# EAGLE design bbb-cc2520 (EAGLE 6.5.0)
AUTHOR: Neal Jackson; REV: D; TITLE: GAP

## Sheet 1 of 5
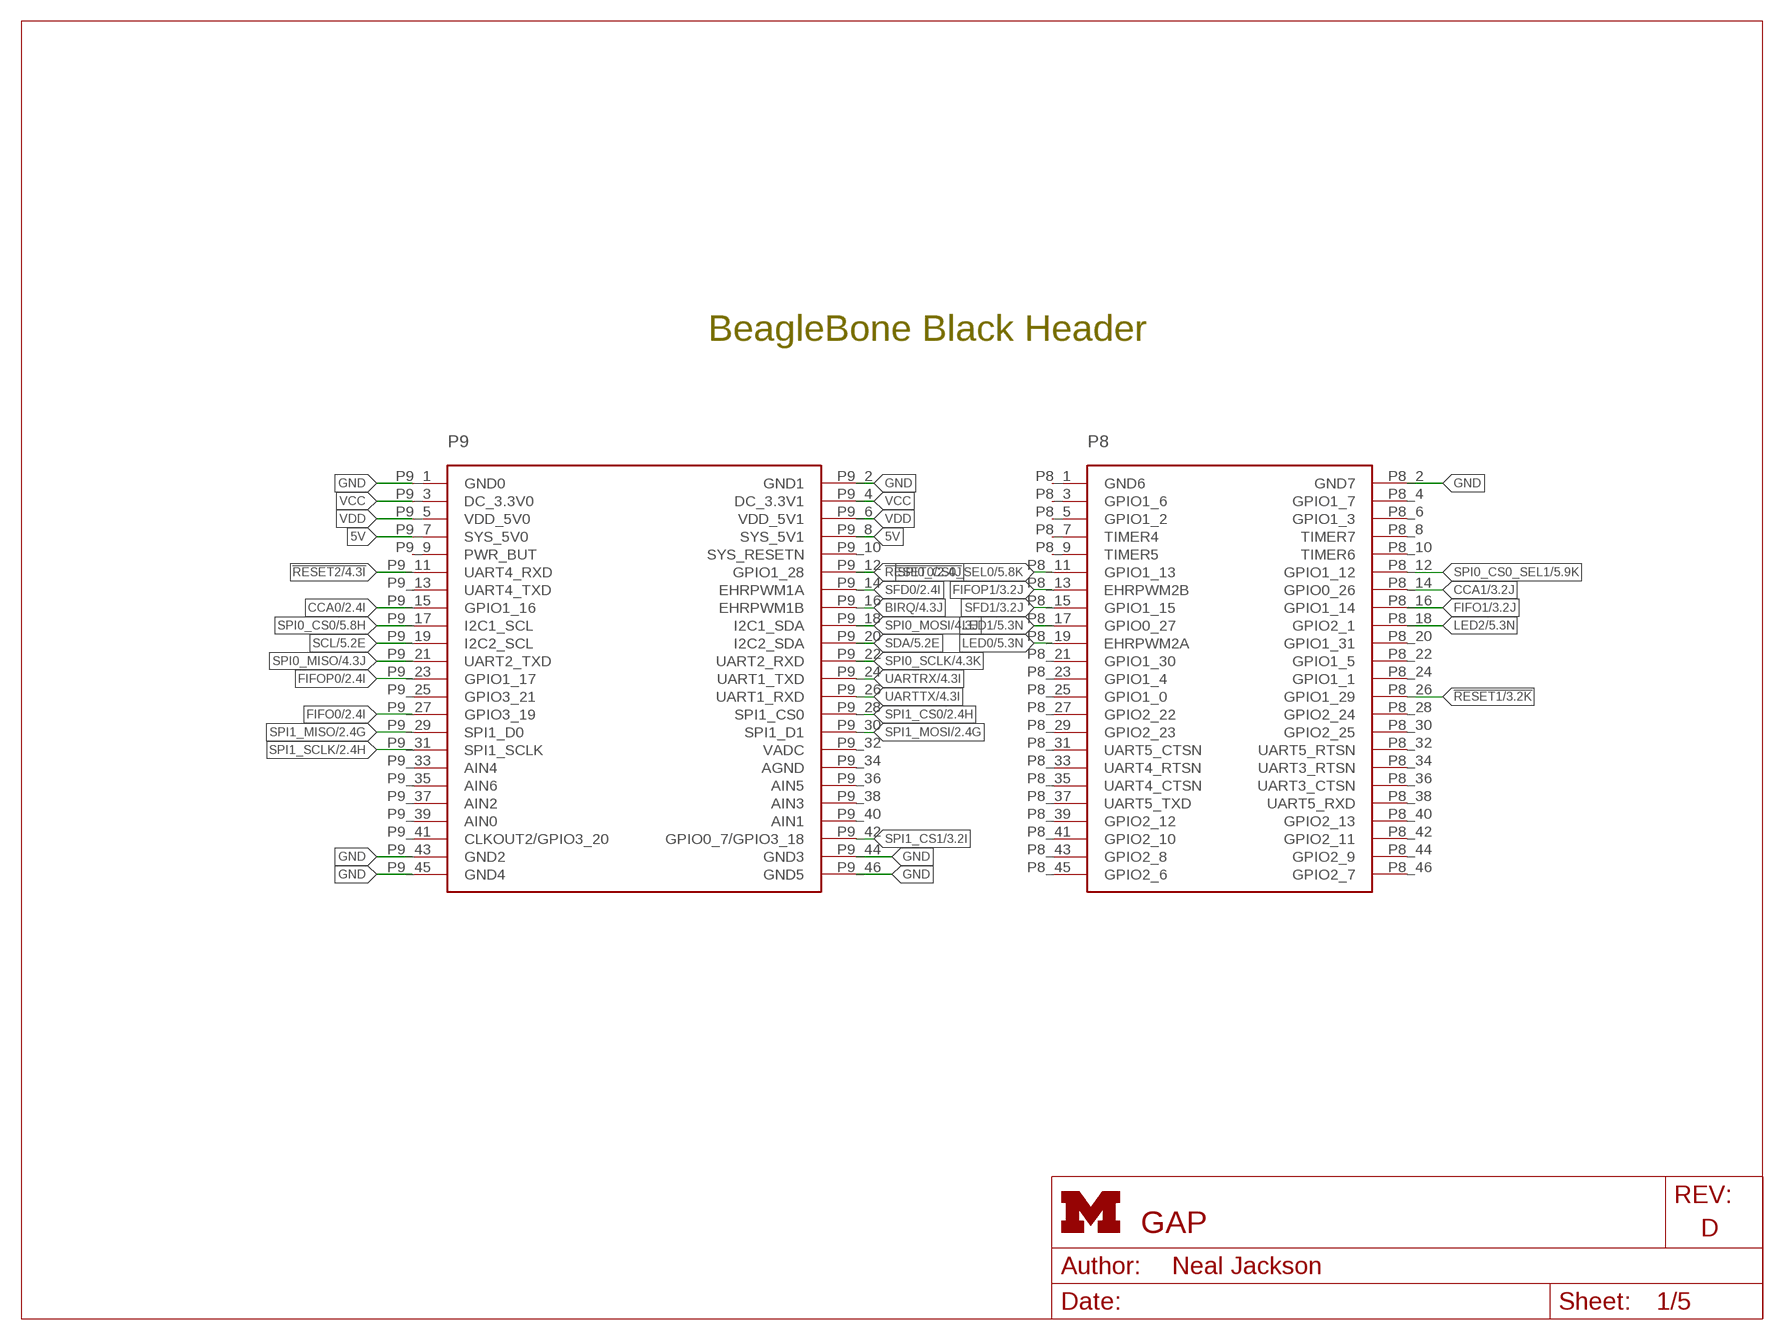
[diagram p0: schematic, sheet 1]
FRAME1 (LETTER_L): HEIGHT: 8.5in; WIDTH: 11in

### Parts
P9/P8  BBB_HEADERS  [BBB_HEADERS]

### Nets
5V: P9/P8.P9_7(SYS_5V0) P9/P8.P9_8(SYS_5V1)
!RESET0: P9/P8.P9_12(GPIO1_28) ; also sheet 2
!RESET1: P9/P8.P8_26(GPIO1_29) ; also sheet 3
!RESET2: P9/P8.P9_11(UART4_RXD) ; also sheet 4
BIRQ: P9/P8.P9_16(EHRPWM1B) ; also sheet 4
CCA0: P9/P8.P9_15(GPIO1_16) ; also sheet 2
CCA1: P9/P8.P8_14(GPIO0_26) ; also sheet 3
FIFO0: P9/P8.P9_27(GPIO3_19) ; also sheet 2
FIFO1: P9/P8.P8_16(GPIO1_14) ; also sheet 3
FIFOP0: P9/P8.P9_23(GPIO1_17) ; also sheet 2
FIFOP1: P9/P8.P8_13(EHRPWM2B) ; also sheet 3
GND: P9/P8.P8_2(GND7) P9/P8.P9_1(GND0) P9/P8.P9_2(GND1) P9/P8.P9_43(GND2) P9/P8.P9_44(GND3) P9/P8.P9_45(GND4) P9/P8.P9_46(GND5) ; also sheet 2,3,4,5
LED0: P9/P8.P8_19(EHRPWM2A) ; also sheet 5
LED1: P9/P8.P8_17(GPIO0_27) ; also sheet 5
LED2: P9/P8.P8_18(GPIO2_1) ; also sheet 5
SCL: P9/P8.P9_19(I2C2_SCL) ; also sheet 5
SDA: P9/P8.P9_20(I2C2_SDA) ; also sheet 5
SFD0: P9/P8.P9_14(EHRPWM1A) ; also sheet 2
SFD1: P9/P8.P8_15(GPIO1_15) ; also sheet 3
SPI0_CS0: P9/P8.P9_17(I2C1_SCL) ; also sheet 5
SPI0_CS0_SEL0: P9/P8.P8_11(GPIO1_13) ; also sheet 5
SPI0_CS0_SEL1: P9/P8.P8_12(GPIO1_12) ; also sheet 5
SPI0_MISO: P9/P8.P9_21(UART2_TXD) ; also sheet 4
SPI0_MOSI: P9/P8.P9_18(I2C1_SDA) ; also sheet 4
SPI0_SCLK: P9/P8.P9_22(UART2_RXD) ; also sheet 4
SPI1_CS0: P9/P8.P9_28(SPI1_CS0) ; also sheet 2
SPI1_CS1: P9/P8.P9_42(GPIO0_7/GPIO3_18) ; also sheet 3
SPI1_MISO: P9/P8.P9_29(SPI1_D0) ; also sheet 2,3
SPI1_MOSI: P9/P8.P9_30(SPI1_D1) ; also sheet 2,3
SPI1_SCLK: P9/P8.P9_31(SPI1_SCLK) ; also sheet 2,3
UARTRX: P9/P8.P9_24(UART1_TXD) ; also sheet 4
UARTTX: P9/P8.P9_26(UART1_RXD) ; also sheet 4
VCC: P9/P8.P9_3(DC_3.3V0) P9/P8.P9_4(DC_3.3V1) ; also sheet 2,3,4,5
VDD: P9/P8.P9_5(VDD_5V0) P9/P8.P9_6(VDD_5V1)
Unconnected: P9/P8.P8_1(GND6) P9/P8.P8_3(GPIO1_6) P9/P8.P8_4(GPIO1_7) P9/P8.P8_5(GPIO1_2) P9/P8.P8_6(GPIO1_3) P9/P8.P8_7(TIMER4) P9/P8.P8_8(TIMER7) P9/P8.P8_9(TIMER5) P9/P8.P8_10(TIMER6) P9/P8.P8_20(GPIO1_31) P9/P8.P8_21(GPIO1_30) P9/P8.P8_22(GPIO1_5) P9/P8.P8_23(GPIO1_4) P9/P8.P8_24(GPIO1_1) P9/P8.P8_25(GPIO1_0) P9/P8.P8_27(GPIO2_22) P9/P8.P8_28(GPIO2_24) P9/P8.P8_29(GPIO2_23) P9/P8.P8_30(GPIO2_25) P9/P8.P8_31(UART5_CTSN) P9/P8.P8_32(UART5_RTSN) P9/P8.P8_33(UART4_RTSN) P9/P8.P8_34(UART3_RTSN) P9/P8.P8_35(UART4_CTSN) P9/P8.P8_36(UART3_CTSN) P9/P8.P8_37(UART5_TXD) P9/P8.P8_38(UART5_RXD) P9/P8.P8_39(GPIO2_12) P9/P8.P8_40(GPIO2_13) P9/P8.P8_41(GPIO2_10) P9/P8.P8_42(GPIO2_11) P9/P8.P8_43(GPIO2_8) P9/P8.P8_44(GPIO2_9) P9/P8.P8_45(GPIO2_6) P9/P8.P8_46(GPIO2_7) P9/P8.P9_9(PWR_BUT) P9/P8.P9_10(SYS_RESETN) P9/P8.P9_13(UART4_TXD) P9/P8.P9_25(GPIO3_21) P9/P8.P9_32(VADC) P9/P8.P9_33(AIN4) P9/P8.P9_34(AGND) P9/P8.P9_35(AIN6) P9/P8.P9_36(AIN5) P9/P8.P9_37(AIN2) P9/P8.P9_38(AIN3) P9/P8.P9_39(AIN0) P9/P8.P9_40(AIN1) P9/P8.P9_41(CLKOUT2/GPIO3_20)

### Notes on the sheet
- BeagleBone Black Header

## Sheet 2 of 5
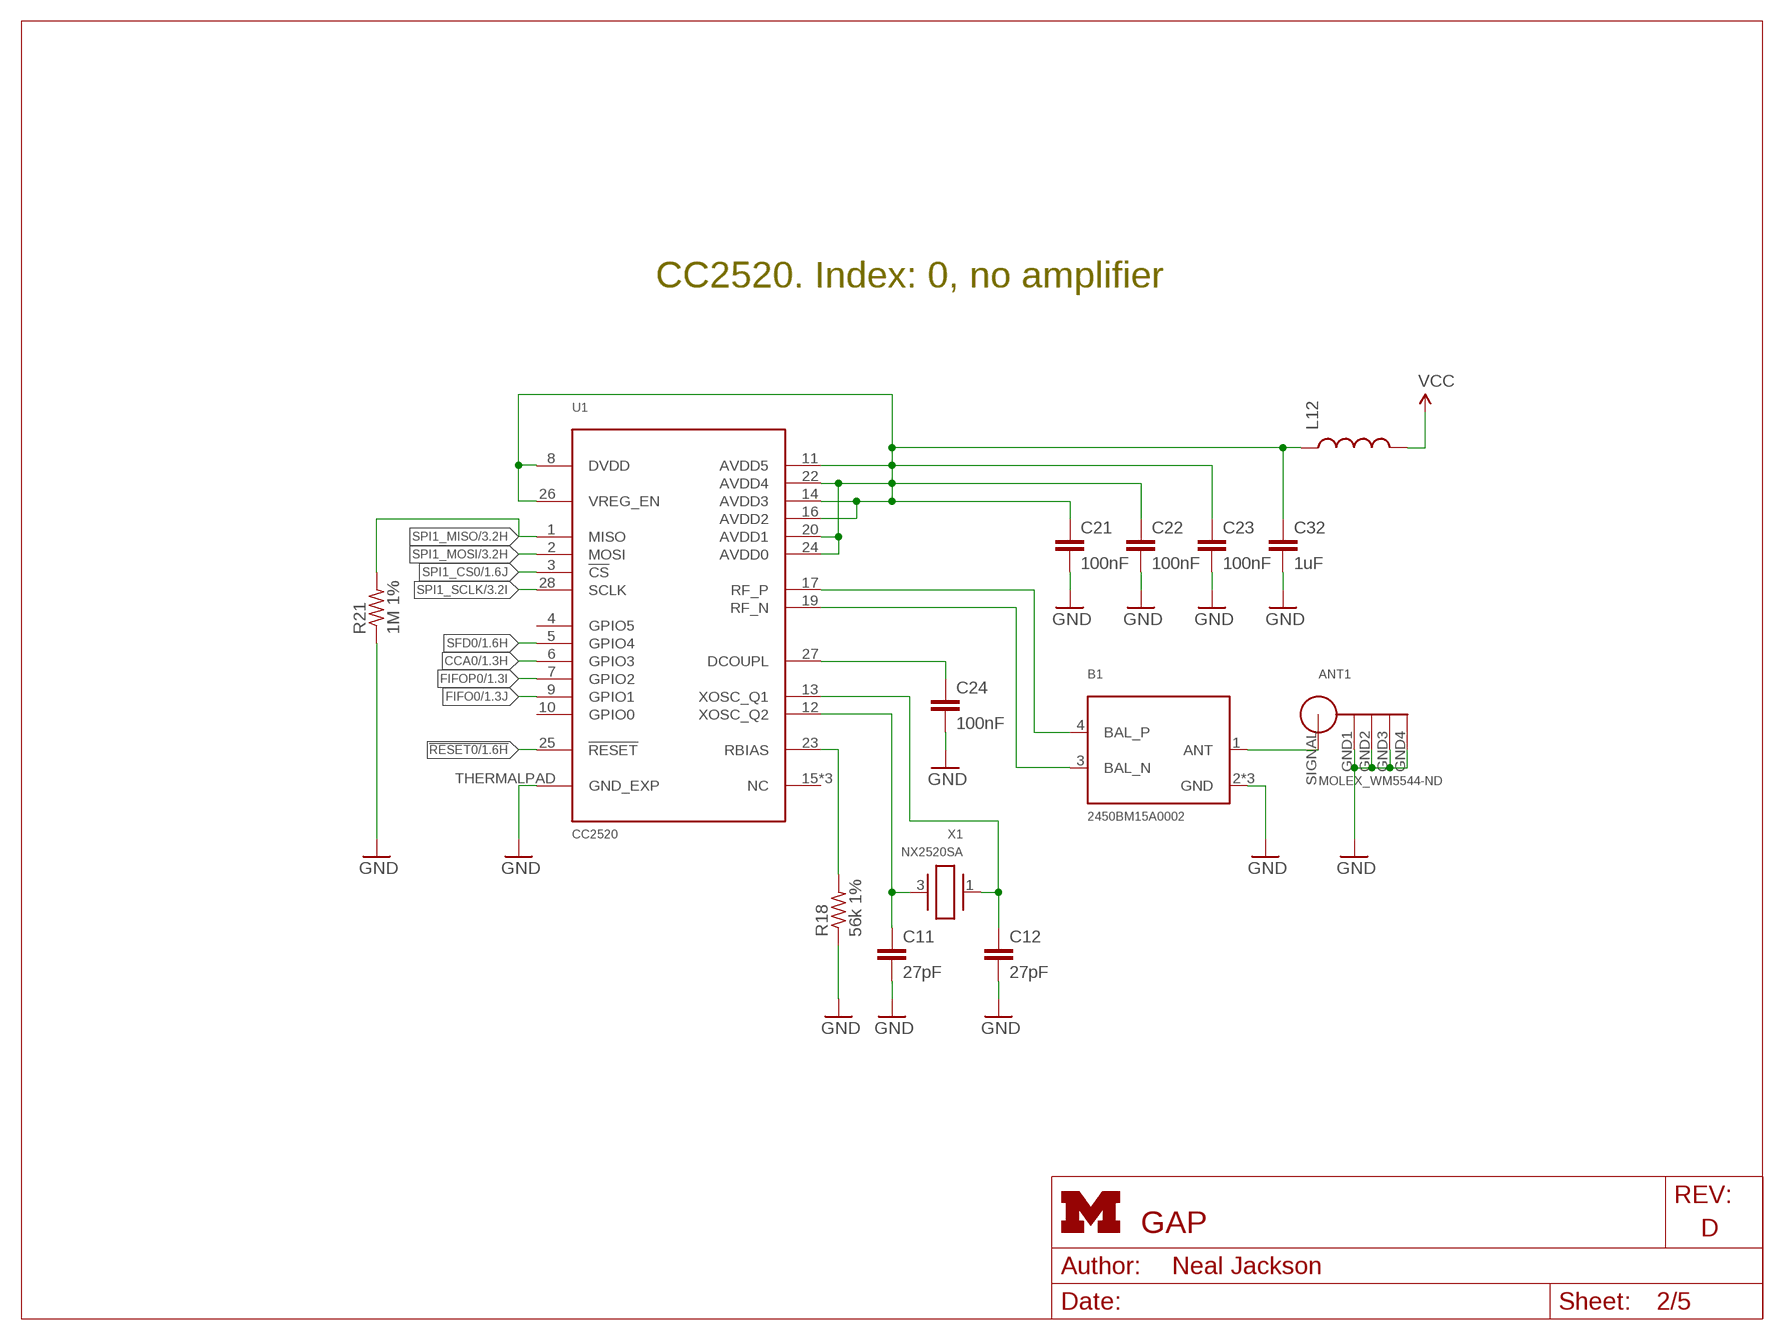
[diagram p1: schematic, sheet 2]
FRAME6 (LETTER_L): HEIGHT: 8.5in; WIDTH: 11in

### Parts
ANT1  MOLEX_WM5544-ND  [MOLEX_WM5544-ND]
B1  2450BM15A0002  [2450BM]
C11  27pF  C-EUC0402  [C0402]
C12  27pF  C-EUC0402  [C0402]
C21  100nF  C-EUC0402  [C0402]
C22  100nF  C-EUC0402  [C0402]
C23  100nF  C-EUC0402  [C0402]
C24  100nF  C-EUC0402  [C0402]
C32  1uF  C-EUC0603  [C0603]
L12  INDUCTOR0603  [0603]
R18  56k 1%  R-US_R0402  [R0402]
R21  1M 1%  R-US_R0402  [R0402]
U1  CC2520  [S-PVQFN-N28]
X1  NX2520SA  [NX2520SA]

### Nets
!RESET0: U1.25(!RESET) ; also sheet 1
CCA0: U1.6(GPIO3) ; also sheet 1
FIFO0: U1.9(GPIO1) ; also sheet 1
FIFOP0: U1.7(GPIO2) ; also sheet 1
GND: ANT1.GND1 ANT1.GND2 ANT1.GND3 ANT1.GND4 B1.2(GND) B1.5(GND) B1.6(GND) C11.2 C12.2 C21.2 C22.2 C23.2 C24.2 C32.2 R18.1 R21.1 U1.THERMALPAD(GND_EXP) ; also sheet 1,3,4,5
N$5: C21.1 C22.1 C23.1 C32.1 L12.1 U1.8(DVDD) U1.11(AVDD5) U1.14(AVDD3) U1.16(AVDD2) U1.20(AVDD1) U1.22(AVDD4) U1.24(AVDD0) U1.26(VREG_EN)
N$7: ANT1.SIGNAL B1.1(ANT)
N$11: C12.1 U1.13(XOSC_Q1) X1.1
N$12: C24.1 U1.27(DCOUPL)
N$13: C11.1 U1.12(XOSC_Q2) X1.3
N$14: R18.2 U1.23(RBIAS)
RF_N: B1.3(BAL_N) U1.19(RF_N)
RF_P: B1.4(BAL_P) U1.17(RF_P)
SFD0: U1.5(GPIO4) ; also sheet 1
SPI1_CS0: U1.3(!CS) ; also sheet 1
SPI1_MISO: R21.2 U1.1(MISO) ; also sheet 1,3
SPI1_MOSI: U1.2(MOSI) ; also sheet 1,3
SPI1_SCLK: U1.28(SCLK) ; also sheet 1,3
VCC: L12.2 ; also sheet 1,3,4,5
Unconnected: U1.4(GPIO5) U1.10(GPIO0) U1.15(NC) U1.18(NC) U1.21(NC)

### Notes on the sheet
- CC2520. Index: 0, no amplifier

## Sheet 3 of 5
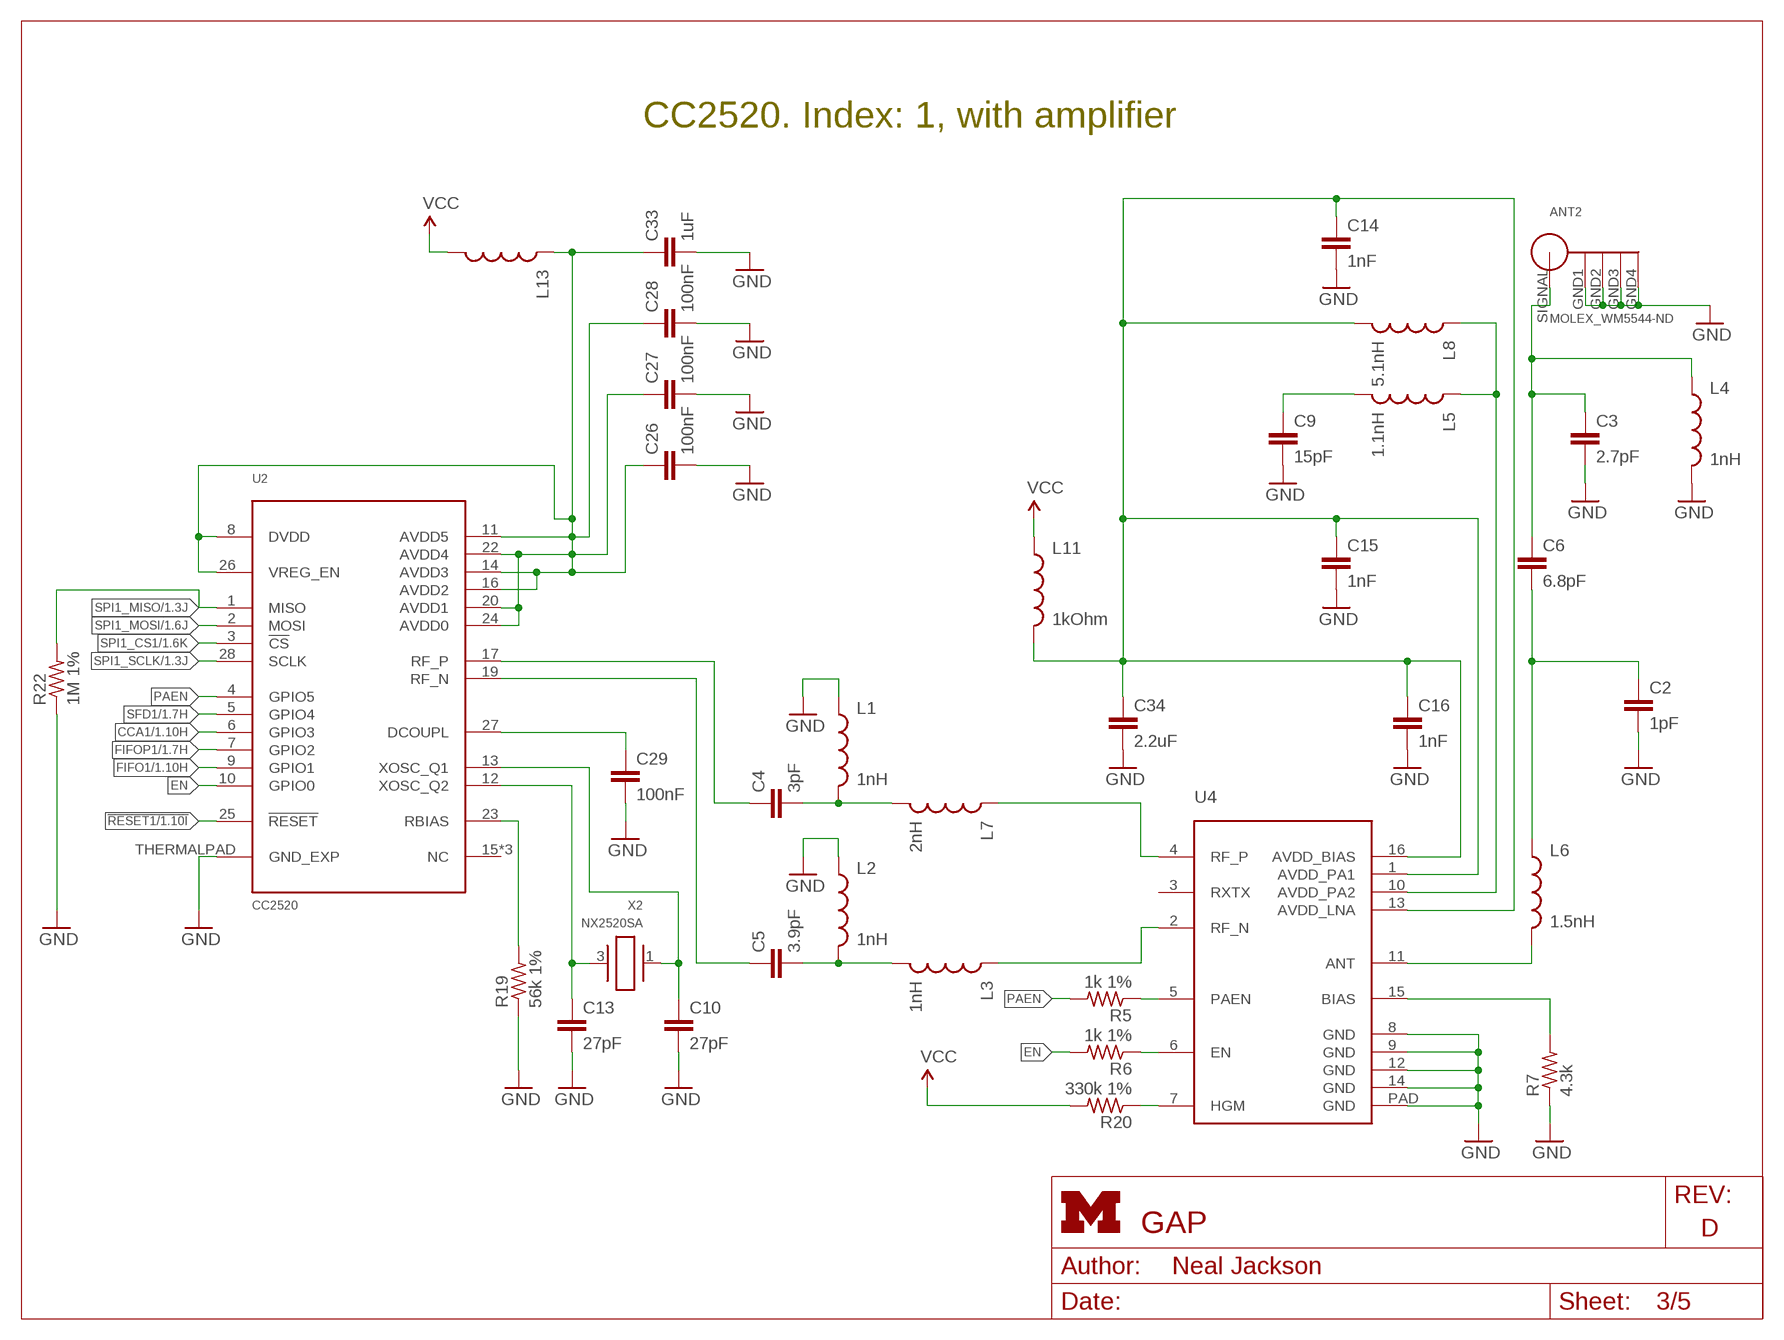
[diagram p2: schematic, sheet 3]
FRAME3 (LETTER_L): HEIGHT: 8.5in; WIDTH: 11in

### Parts
ANT2  MOLEX_WM5544-ND  [MOLEX_WM5544-ND]
C2  1pF  C-EUC0402  [C0402]
C3  2.7pF  C-EUC0402  [C0402]
C4  3pF  C-EUC0402  [C0402]
C5  3.9pF  C-EUC0402  [C0402]
C6  6.8pF  C-EUC0402  [C0402]
C9  15pF  C-EUC0402  [C0402]
C10  27pF  C-EUC0402  [C0402]
C13  27pF  C-EUC0402  [C0402]
C14  1nF  C-EUC0402  [C0402]
C15  1nF  C-EUC0402  [C0402]
C16  1nF  C-EUC0402  [C0402]
C26  100nF  C-EUC0402  [C0402]
C27  100nF  C-EUC0402  [C0402]
C28  100nF  C-EUC0402  [C0402]
C29  100nF  C-EUC0402  [C0402]
C33  1uF  C-EUC0603  [C0603]
C34  2.2uF  C-EUC0402  [C0402]
L1  1nH  INDUCTOR0402  [C0402]
L2  1nH  INDUCTOR0402  [C0402]
L3  1nH  INDUCTOR0402  [C0402]
L4  1nH  INDUCTOR0402  [C0402]
L5  1.1nH  INDUCTOR0402  [C0402]
L6  1.5nH  INDUCTOR0402  [C0402]
L7  2nH  INDUCTOR0402  [C0402]
L8  5.1nH  INDUCTOR0402  [C0402]
L11  1kOhm  INDUCTOR0402  [C0402]
L13  INDUCTOR0603  [0603]
R5  1k 1%  R-US_R0402  [R0402]
R6  1k 1%  R-US_R0402  [R0402]
R7  4.3k  R-US_R0402  [R0402]
R19  56k 1%  R-US_R0402  [R0402]
R20  330k 1%  R-US_R0402  [R0402]
R22  1M 1%  R-US_R0402  [R0402]
U2  CC2520  [S-PVQFN-N28]
U4  CC2591  [PVQFN-16]
X2  NX2520SA  [NX2520SA]

### Nets
!RESET1: U2.25(!RESET) ; also sheet 1
CCA1: U2.6(GPIO3) ; also sheet 1
EN: R6.2 U2.10(GPIO0)
FIFO1: U2.9(GPIO1) ; also sheet 1
FIFOP1: U2.7(GPIO2) ; also sheet 1
GND: ANT2.GND1 ANT2.GND2 ANT2.GND3 ANT2.GND4 C2.2 C3.2 C9.2 C10.2 C13.2 C14.2 C15.2 C16.2 C26.2 C27.2 C28.2 C29.2 C33.2 C34.2 L1.1 L2.1 L4.2 R7.1 R19.1 R22.1 U2.THERMALPAD(GND_EXP) U4.8(GND) U4.9(GND) U4.12(GND) U4.14(GND) U4.PAD(GND) ; also sheet 1,2,4,5
N$44: L7.1 U4.4(RF_P)
N$45: L3.1 U4.2(RF_N)
N$46: C5.2 L2.2 L3.2
N$47: C4.2 L1.2 L7.2
N$48: L5.1 L8.1 U4.10(AVDD_PA2)
N$49: C14.1 C15.1 C16.1 C34.1 L8.2 L11.2 U4.1(AVDD_PA1) U4.13(AVDD_LNA) U4.16(AVDD_BIAS)
N$50: C9.1 L5.2
N$51: L6.2 U4.11(ANT)
N$52: ANT2.SIGNAL C3.1 C6.1 L4.1
N$53: C2.1 C6.2 L6.1
N$54: R7.2 U4.15(BIAS)
N$55: R5.1 U4.5(PAEN)
N$56: R6.1 U4.6(EN)
N$57: C26.1 C27.1 C28.1 C33.1 L13.1 U2.8(DVDD) U2.11(AVDD5) U2.14(AVDD3) U2.16(AVDD2) U2.20(AVDD1) U2.22(AVDD4) U2.24(AVDD0) U2.26(VREG_EN)
N$58: C29.1 U2.27(DCOUPL)
N$59: C10.1 U2.13(XOSC_Q1) X2.1
N$60: C13.1 U2.12(XOSC_Q2) X2.3
N$61: R19.2 U2.23(RBIAS)
N$62: R20.1 U4.7(HGM)
PAEN: R5.2 U2.4(GPIO5)
RF_N2: C5.1 U2.19(RF_N)
RF_P2: C4.1 U2.17(RF_P)
SFD1: U2.5(GPIO4) ; also sheet 1
SPI1_CS1: U2.3(!CS) ; also sheet 1
SPI1_MISO: R22.2 U2.1(MISO) ; also sheet 1,2
SPI1_MOSI: U2.2(MOSI) ; also sheet 1,2
SPI1_SCLK: U2.28(SCLK) ; also sheet 1,2
VCC: L11.1 L13.2 R20.2 ; also sheet 1,2,4,5
Unconnected: U2.15(NC) U2.18(NC) U2.21(NC) U4.3(RXTX)

### Notes on the sheet
- CC2520. Index: 1, with amplifier

## Sheet 4 of 5
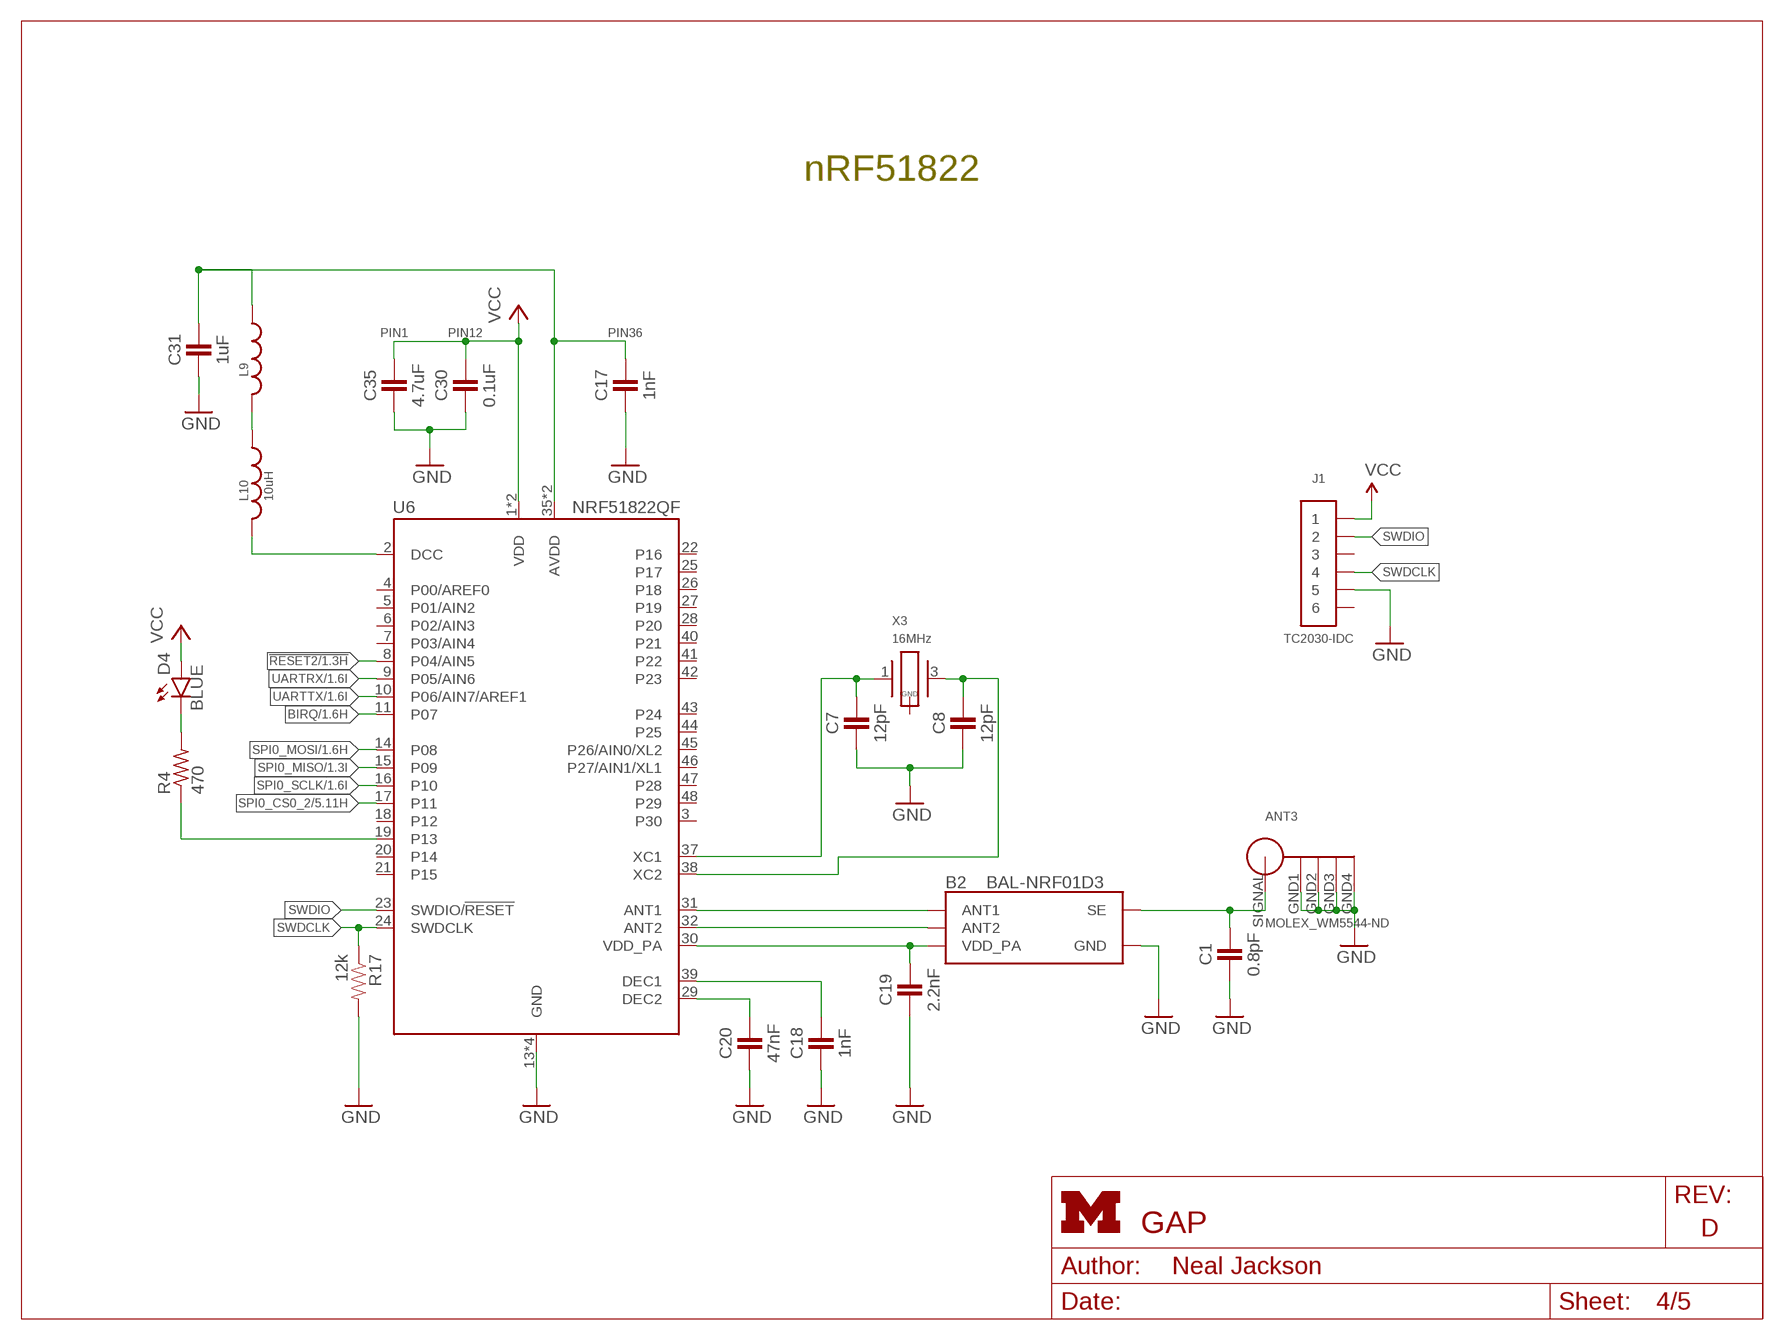
[diagram p3: schematic, sheet 4]
FRAME2 (LETTER_L): HEIGHT: 8.5in; WIDTH: 11in

### Parts
ANT3  MOLEX_WM5544-ND  [MOLEX_WM5544-ND]
B2  BAL-NRF01D3  [BAL-NRF01D3]
C1  0.8pF  CAPACITOR  [0402_CAP]
C7  12pF  CAPACITOR  [0402_CAP]
C8  12pF  CAPACITOR  [0402_CAP]
C17  1nF  CAPACITOR  [0402_CAP]
C18  1nF  CAPACITOR  [0402_CAP]
C19  2.2nF  CAPACITOR  [0402_CAP]
C20  47nF  CAPACITOR  [0402_CAP]
C30  0.1uF  CAPACITOR  [0402_CAP]
C31  1uF  CAPACITOR  [0402_CAP]
C35  4.7uF  CAPACITOR  [0402_CAP]
D4  BLUE  LED0603  [LED-0603]
J1  TC2030-IDC  [TC2030-IDC]
L9  INDUCTOR0402  [0402_CAP]
L10  10uH  INDUCTOR0603  [0603_CAP]
R4  470  R-US_R0402  [R0402]
R17  12k  RESISTOR  [0603-RES]
U6  NRF51822QF  [QFN-48-6MM]
X3  16MHz  TXC-8Y  [TXC-8Y]

### Nets
!RESET2: U6.8(P04/AIN5) ; also sheet 1
AVDD: C17.1 C31.1 L9.1 U6.35(AVDD) U6.36(AVDD)
BIRQ: U6.11(P07) ; also sheet 1
DCC: L10.2 U6.2(DCC)
GND: ANT3.GND1 ANT3.GND2 ANT3.GND3 ANT3.GND4 B2.GND C1.2 C7.2 C8.2 C17.2 C18.2 C19.2 C20.2 C30.2 C31.2 C35.2 J1.5 R17.2 U6.13(GND) U6.33(GND) U6.34(GND) U6.GND ; also sheet 1,2,3,5
N$36: B2.ANT1 U6.31(ANT1)
N$37: B2.ANT2 U6.32(ANT2)
N$38: ANT3.SIGNAL B2.SE C1.1
N$39: L9.2 L10.1
N$40: C7.1 U6.37(XC1) X3.1
N$41: C8.1 U6.38(XC2) X3.3
N$42: C18.1 U6.39(DEC1)
N$43: C20.1 U6.29(DEC2)
N$63: D4.C R4.2
N$64: R4.1 U6.19(P13)
SPI0_CS0_2: U6.17(P11) ; also sheet 5
SPI0_MISO: U6.15(P09) ; also sheet 1
SPI0_MOSI: U6.14(P08) ; also sheet 1
SPI0_SCLK: U6.16(P10) ; also sheet 1
SWDCLK: J1.4 R17.1 U6.24(SWDCLK)
SWDIO: J1.2 U6.23(SWDIO/!RESET)
UARTRX: U6.9(P05/AIN6) ; also sheet 1
UARTTX: U6.10(P06/AIN7/AREF1) ; also sheet 1
VCC: C30.1 C35.1 D4.A J1.1 U6.1(VDD) U6.12(VDD) ; also sheet 1,2,3,5
VDD_PA: B2.VCC(VDD_PA) C19.1 U6.30(VDD_PA)
Unconnected: J1.3 J1.6 U6.3(P30) U6.4(P00/AREF0) U6.5(P01/AIN2) U6.6(P02/AIN3) U6.7(P03/AIN4) U6.18(P12) U6.20(P14) U6.21(P15) U6.22(P16) U6.25(P17) U6.26(P18) U6.27(P19) U6.28(P20) U6.40(P21) U6.41(P22) U6.42(P23) U6.43(P24) U6.44(P25) U6.45(P26/AIN0/XL2) U6.46(P27/AIN1/XL1) U6.47(P28) U6.48(P29) X3.2(GND) X3.4(GND)

### Notes on the sheet
- nRF51822
- PIN1 | PIN12 | PIN36

## Sheet 5 of 5
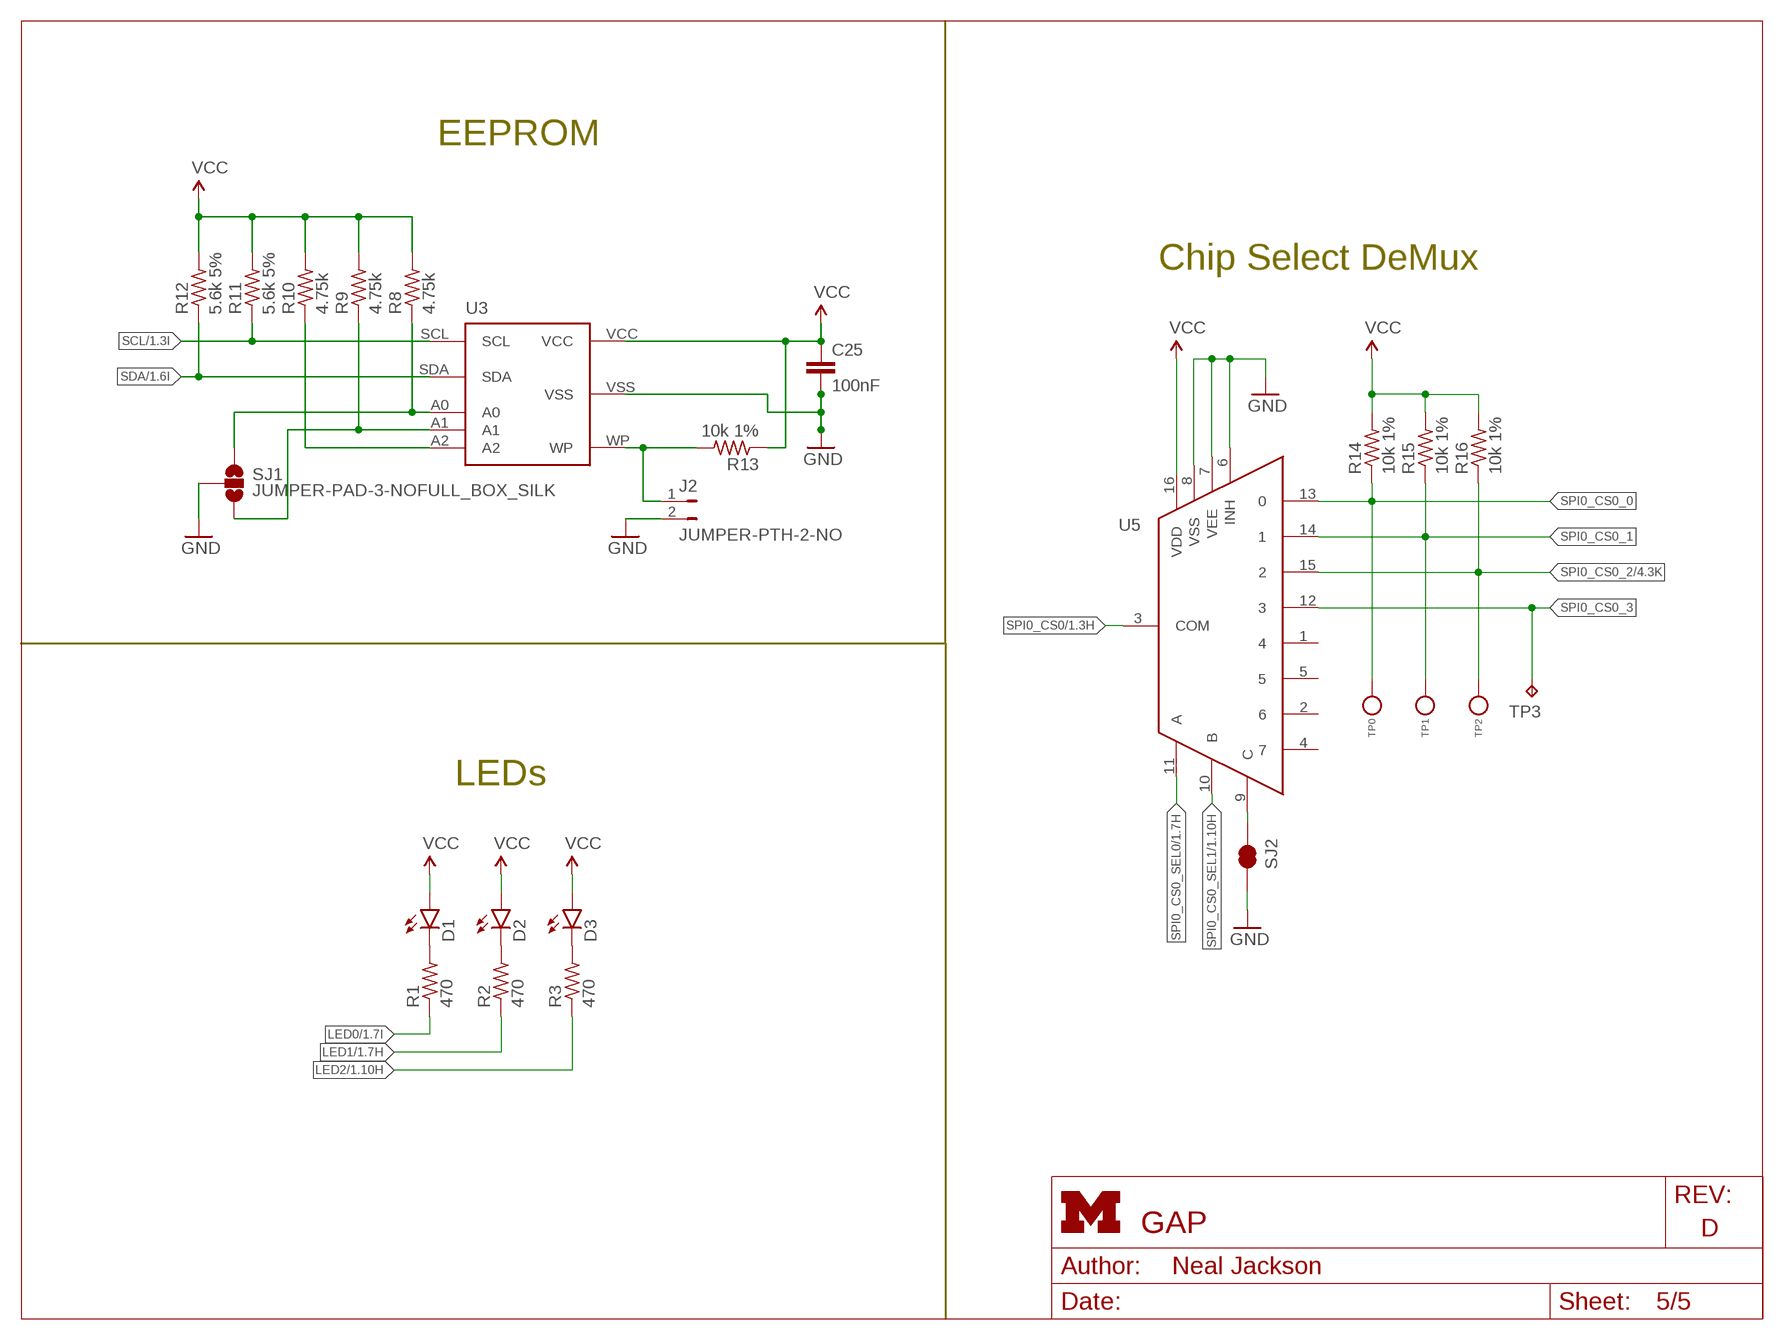
[diagram p4: schematic, sheet 5]
FRAME4 (LETTER_L): HEIGHT: 8.5in; WIDTH: 11in

### Parts
C25  100nF  C-EUC0402  [C0402]
D1  LED0603  [LED-0603]
D2  LED0603  [LED-0603]
D3  LED0603  [LED-0603]
J2  JUMPER-PTH-2-NO  [PTH-JUMPER-2-NO_NO_SILK]
R1  470  R-US_R0402  [R0402]
R2  470  R-US_R0402  [R0402]
R3  470  R-US_R0402  [R0402]
R8  4.75k  R-US_R0402  [R0402]
R9  4.75k  R-US_R0402  [R0402]
R10  4.75k  R-US_R0402  [R0402]
R11  5.6k 5%  R-US_R0402  [R0402]
R12  5.6k 5%  R-US_R0402  [R0402]
R13  10k 1%  R-US_R0402  [R0402]
R14  10k 1%  R-US_R0402  [R0402]
R15  10k 1%  R-US_R0402  [R0402]
R16  10k 1%  R-US_R0402  [R0402]
SJ1  JUMPER-PAD-3-NOFULL_BOX_SILK  [PAD-JUMPER-3-NO_YES_SILK_FULL_BOX]
SJ2  JUMPER-PAD-2-NC_BY_TRACE  [PAD-JUMPER-2-NC_BY_TRACE_YES_SILK]
TP0  TEST_POINT_0.040IN  [TESTPOINT_0.040IN]
TP1  TEST_POINT_0.040IN  [TESTPOINT_0.040IN]
TP2  TEST_POINT_0.040IN  [TESTPOINT_0.040IN]
TP3  TPTP14SQ  [TP14SQ]
U3  CAT24C256WI-GT3  [CAT24C256WI-GT3]
U5  CD4051B-53B  [TSSOP16]

### Nets
GND: C25.2 J2.2 SJ1.2 SJ2.2 U3.VSS U5.6(INH) U5.7(VEE) U5.8(VSS) ; also sheet 1,2,3,4
LED0: R1.1 ; also sheet 1
LED1: R2.1 ; also sheet 1
LED2: R3.1 ; also sheet 1
N$1: D1.C R1.2
N$2: D2.C R2.2
N$3: D3.C R3.2
N$29: R8.1 SJ1.1 U3.A0
N$30: R9.1 SJ1.3 U3.A1
N$31: J2.1 R13.2 U3.WP
N$32: R10.1 U3.A2
N$65: SJ2.1 U5.9(C)
SCL: R11.1 U3.SCL ; also sheet 1
SDA: R12.1 U3.SDA ; also sheet 1
SPI0_CS0: U5.3(COM) ; also sheet 1
SPI0_CS0_0: R14.1 TP0.TESTPOINT U5.13
SPI0_CS0_1: R15.1 TP1.TESTPOINT U5.14
SPI0_CS0_2: R16.1 TP2.TESTPOINT U5.15 ; also sheet 4
SPI0_CS0_3: TP3.TP U5.12
SPI0_CS0_SEL0: U5.11(A) ; also sheet 1
SPI0_CS0_SEL1: U5.10(B) ; also sheet 1
VCC: C25.1 D1.A D2.A D3.A R8.2 R9.2 R10.2 R11.2 R12.2 R13.1 R14.2 R15.2 R16.2 U3.VCC U5.16(VDD) ; also sheet 1,2,3,4
Unconnected: U5.1 U5.2 U5.4 U5.5

### Notes on the sheet
- EEPROM
- Chip Select DeMux
- LEDs

## Library data of the parts
ANT1-ANT3 = connector:MOLEX_WM5544-ND: Through-hole SMA Antenna; DIGIKEY: WM5544-ND
B1 = rpi-cc2520:2450BM15A0002: BALUN JTI MATCHED ZIGBEE; DIGIKEY: 712-1536-1-ND
B2 = chips:BAL-NRF01D3: 50 ohm nominal input / conjugate match balun to nRF51422-QFAA, nRF24LE1, nRF51822-QFAA/AB, with integrated harmonic filter; DIGIKEY: 497-13637-1-ND; MOUSER: 511-BAL-NRF01D3
C1 C19 = passives:CAPACITOR: 0402 Capacitor; DIGIKEY: 490-5419-1-ND
C2-C6 C9 C14-C16 C21-C29 C34 = rcl:C-EU: CAPACITOR, European symbol; DIGIKEY: 490-1318-1-ND
C7 C8 = passives:CAPACITOR: 0402 Capacitor; DIGIKEY: 490-6197-1-ND
C10-C13 = rcl:C-EU: CAPACITOR, European symbol; DIGIKEY: 490-5869-1-ND
C17 C18 = passives:CAPACITOR: 0402 Capacitor; DIGIKEY: 490-1303-1-ND
C20 = passives:CAPACITOR: 0402 Capacitor; DIGIKEY: 445-1264-1-ND
C30 = passives:CAPACITOR: 0402 Capacitor; DIGIKEY: 445-4952-1-ND
C31 = passives:CAPACITOR: 0402 Capacitor; DIGIKEY: 1276-1513-1-ND
C32 C33 = rcl:C-EU: CAPACITOR, European symbol; DIGIKEY: 490-1550-1-ND
C35 = passives:CAPACITOR: 0402 Capacitor; DIGIKEY: 445-5947-1-ND
D1 = SparkFun-LED:LED: LEDs Standard schematic elements and footprints for 5mm, 3mm, 1206, and 0603 sized LEDs. 5mm - Spark Fun Electronics SKU : COM-00529 (and others); DIGIKEY: 160-1834-1-ND
D2 = SparkFun-LED:LED: LEDs Standard schematic elements and footprints for 5mm, 3mm, 1206, and 0603 sized LEDs. 5mm - Spark Fun Electronics SKU : COM-00529 (and others); DIGIKEY: 160-1835-1-ND
D3 = SparkFun-LED:LED: LEDs Standard schematic elements and footprints for 5mm, 3mm, 1206, and 0603 sized LEDs. 5mm - Spark Fun Electronics SKU : COM-00529 (and others); DIGIKEY: 160-1837-1-ND
D4 = SparkFun-LED:LED: LEDs Standard schematic elements and footprints for 5mm, 3mm, 1206, and 0603 sized LEDs. 5mm - Spark Fun Electronics SKU : COM-00529 (and others)
J1 = connector:TC2030-IDC: The TC2030-IDC is our "Legged" 6-pin Plug-of-Nailstm Cable fitted with a 6-pin 0.1" pitch ribbon connector.; TAGCONNECT: TC2030-IDC
J2 = SparkFun-Passives:JUMPER-PTH-2-NO
L1-L8 L11 = SparkFun-Passives:INDUCTOR: Inductors Basic Inductor/Choke - 0603 and 1206. Footprints are not proven and vary greatly between part numbers.
L9 = passives:INDUCTOR; DIGIKEY: 587-1521-1-ND
L10 = passives:INDUCTOR; DIGIKEY: 490-4025-1-ND
L12 L13 = SparkFun-Passives:INDUCTOR: Inductors Basic Inductor/Choke - 0603 and 1206. Footprints are not proven and vary greatly between part numbers.; DIGIKEY: 490-1015-1-ND
P9/P8 = bbb-cc2520:BBB_HEADERS: Pin Header 2x23
R1-R4 = rcl:R-US_: RESISTOR, American symbol; DIGIKEY: RHM470JCT-ND
R5-R7 R18-R20 = rcl:R-US_: RESISTOR, American symbol; DIGIKEY: P56.0KLCT-ND
R8-R16 R21 R22 = rcl:R-US_: RESISTOR, American symbol; DIGIKEY: RHM1.00MCDCT-ND
R17 = passives:RESISTOR: Resistor Basic schematic elements and footprints for 0603, 1206, and PTH resistors.; DIGIKEY: RHM12.0KCDCT-ND
SJ1 = SparkFun-Passives:JUMPER-PAD-3-NO
SJ2 = SparkFun-Passives:JUMPER-PAD-2-NC_BY_TRACE
TP0 TP1 TP2 = headers:TEST_POINT_0.040IN: 0.040in Test Point; DIGIKEY: 5001K-ND
TP3 = testpad:TP: Test pad
U1 U2 = chips:CC2520: 2.4 GHZ IEEE 802.15.4/ZIGBEE® RF TRANSCEIVER; DIGIKEY: 296-22996-1-ND
U3 = bbb-cc2520:CAT24C256: 256kb Serial CMOS EEPROM, organized as 32,768 words of 8 bits each
U4 = bbb-cc2520:CC2591
U5 = bbb-cc2520:CD4051B-53B: IC MUX/DEMUX 8x1 16TSSOP; DIGIKEY: 296-11993-1-ND
U6 = chips:NRF51822: Multiprotocol Bluetooth® 4.0 low energy/2.4 GHz RF SoC; DIGIKEY: 1490-1032-1-ND; MOUSER: 949-NRF51822-QFAB-R7
X1 X2 = rpi-cc2520:NX2520SA: CRYSTAL 32MHZ 10PF SMD; DIGIKEY: 644-1065-1-ND
X3 = crystals:TXC-8Y: 2mmx1.6mm SMD Crystal; DIGIKEY: 887-2003-1-ND

## Board
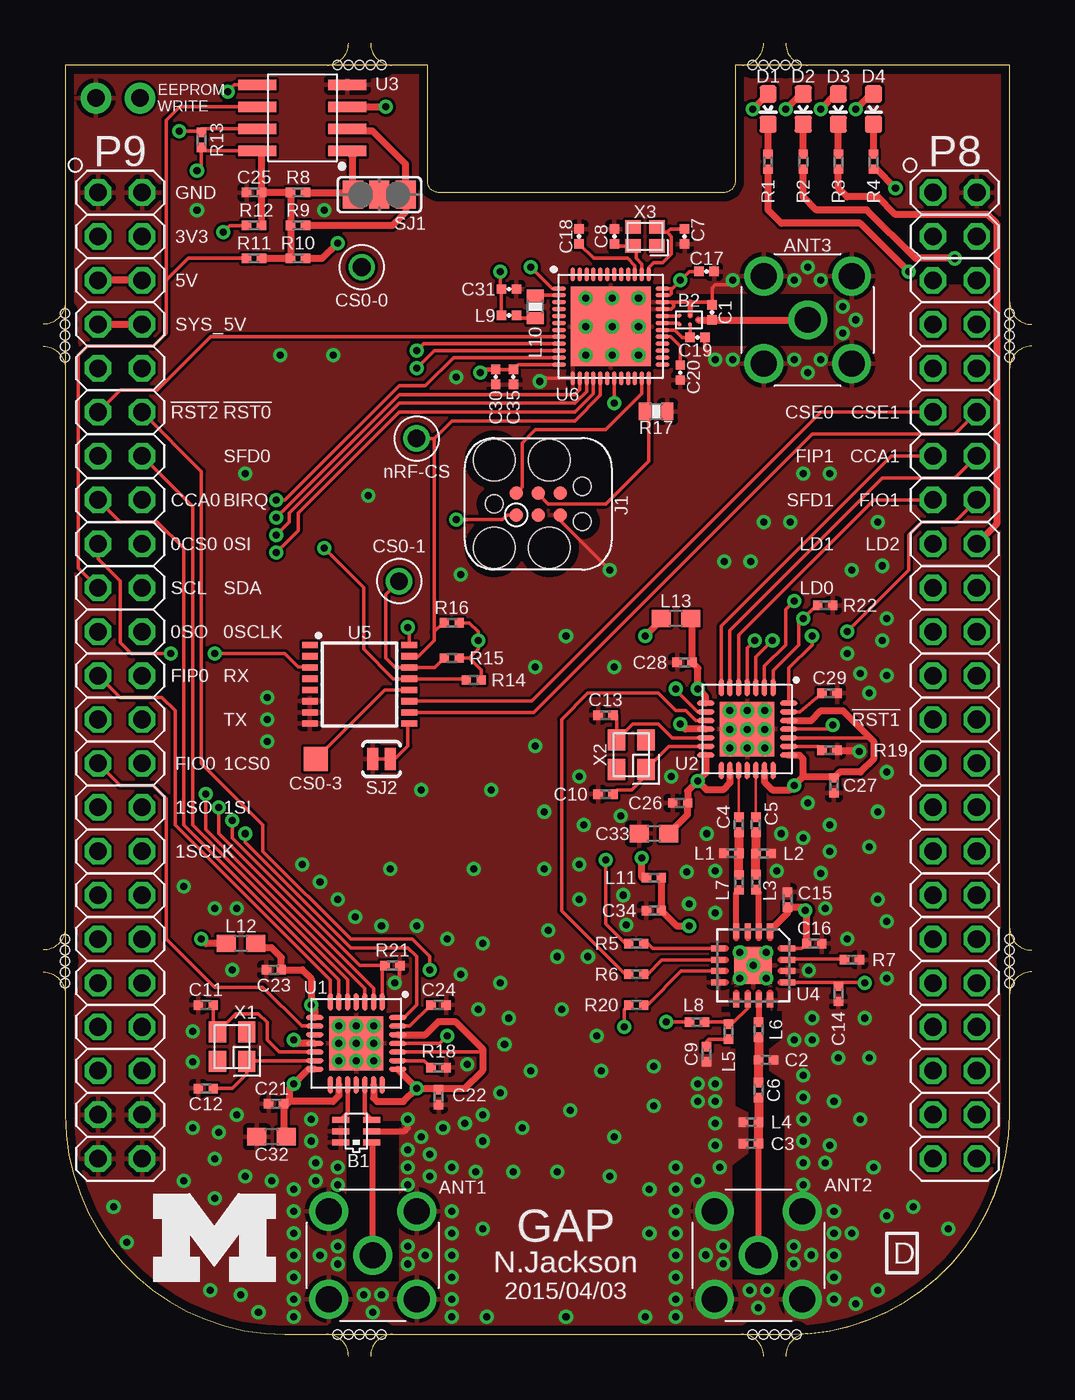
[diagram p5: board, top side]
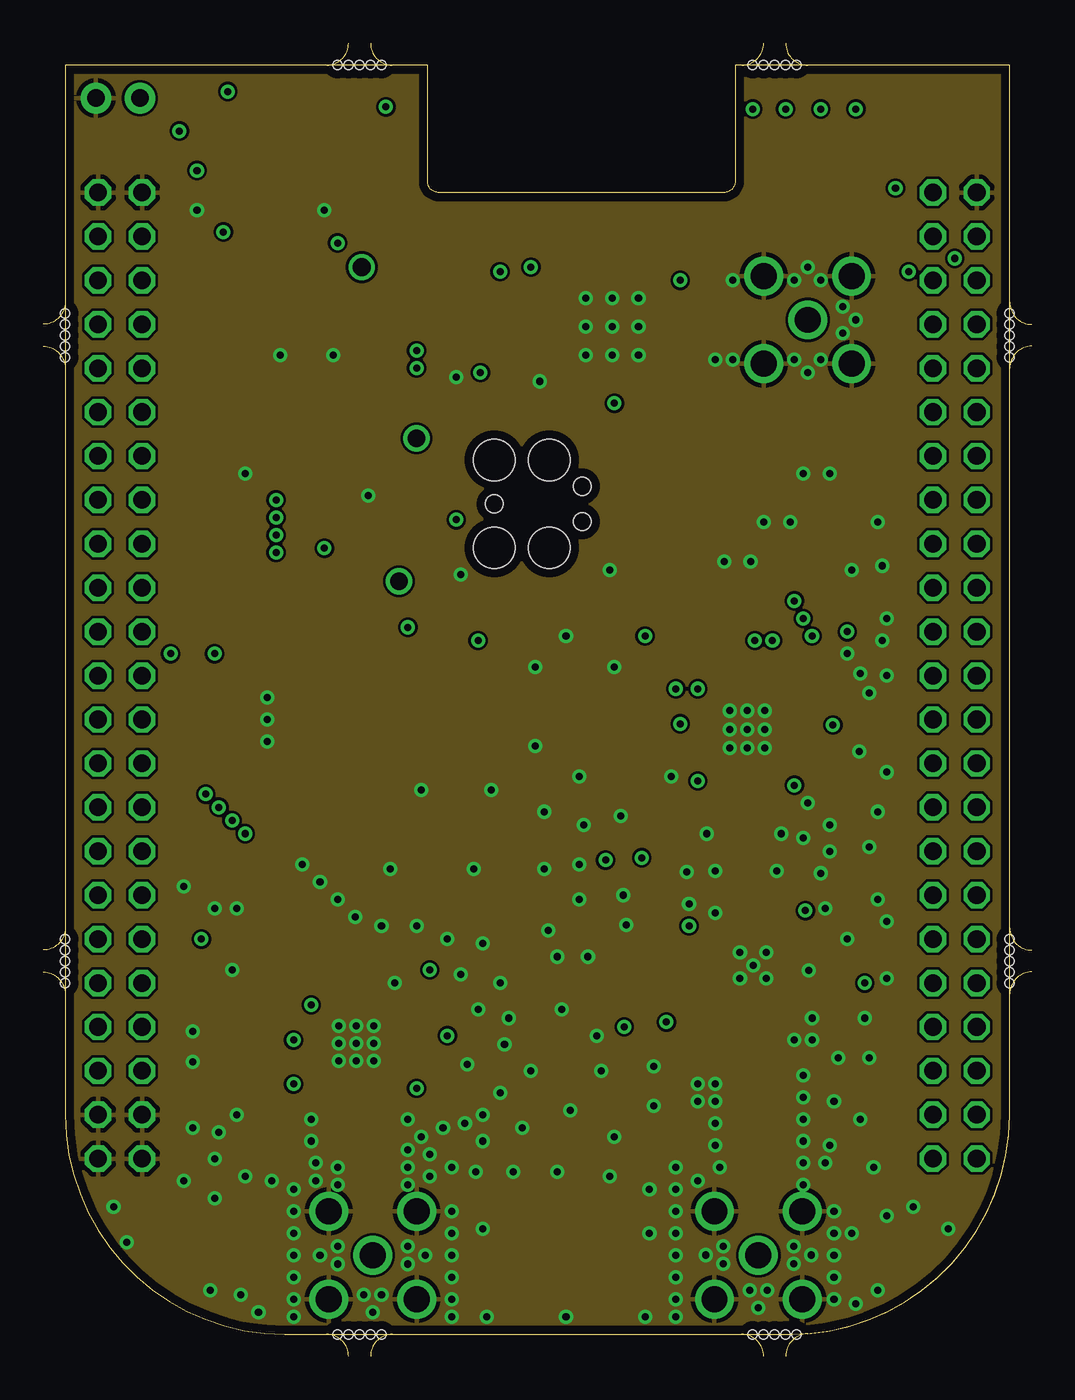
[diagram p6: board, inner layer GND]
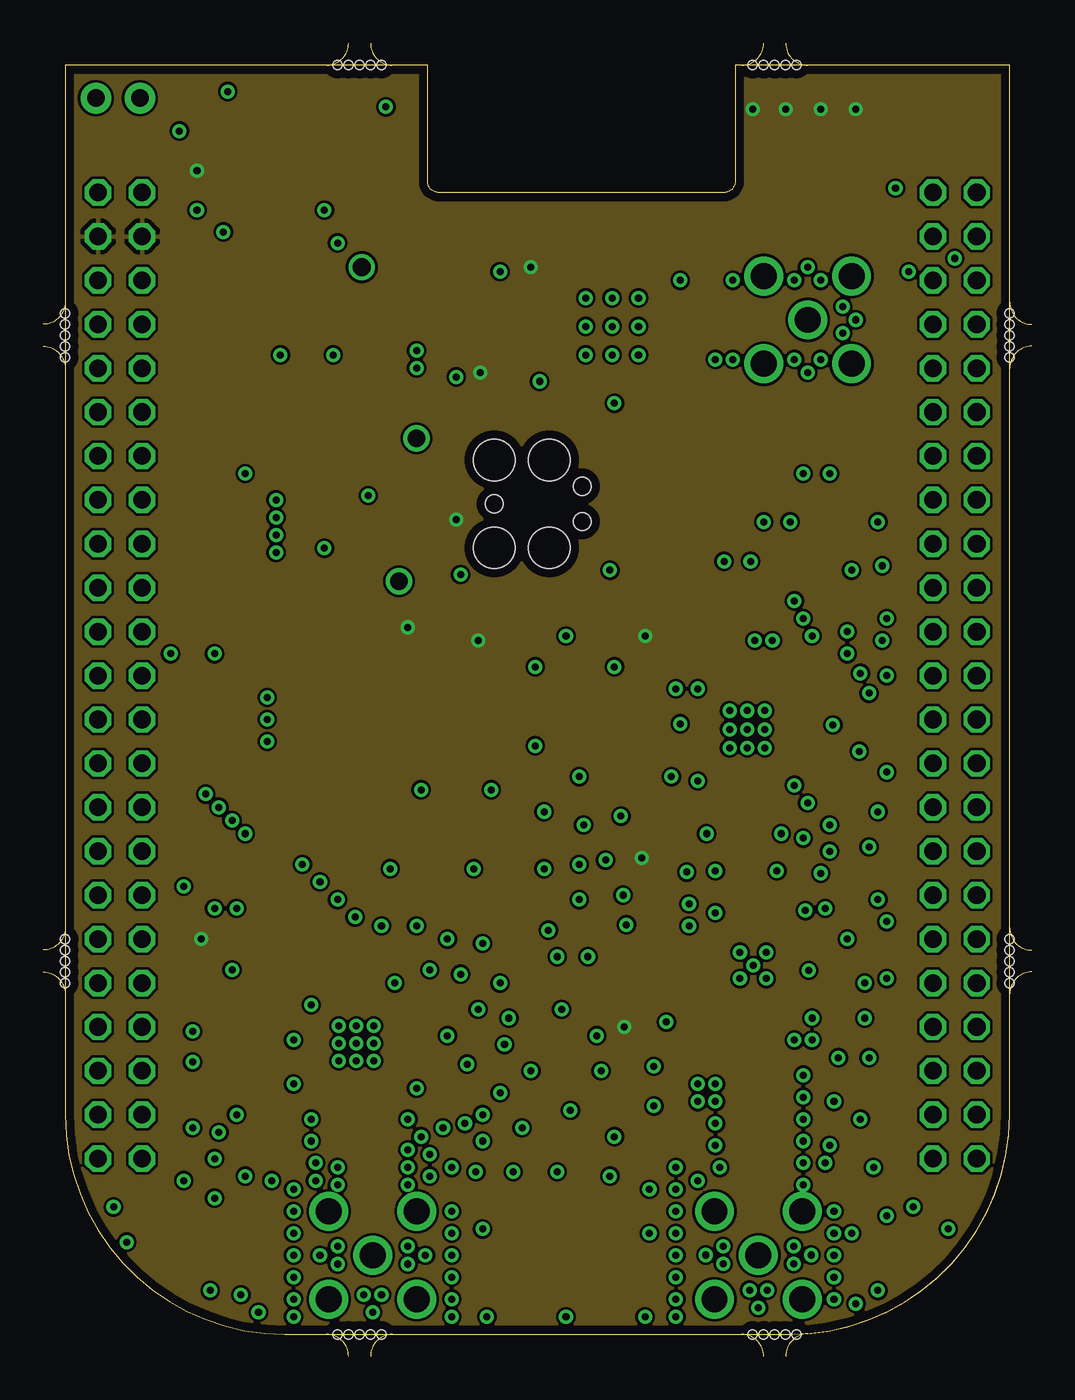
[diagram p7: board, inner layer VCC]
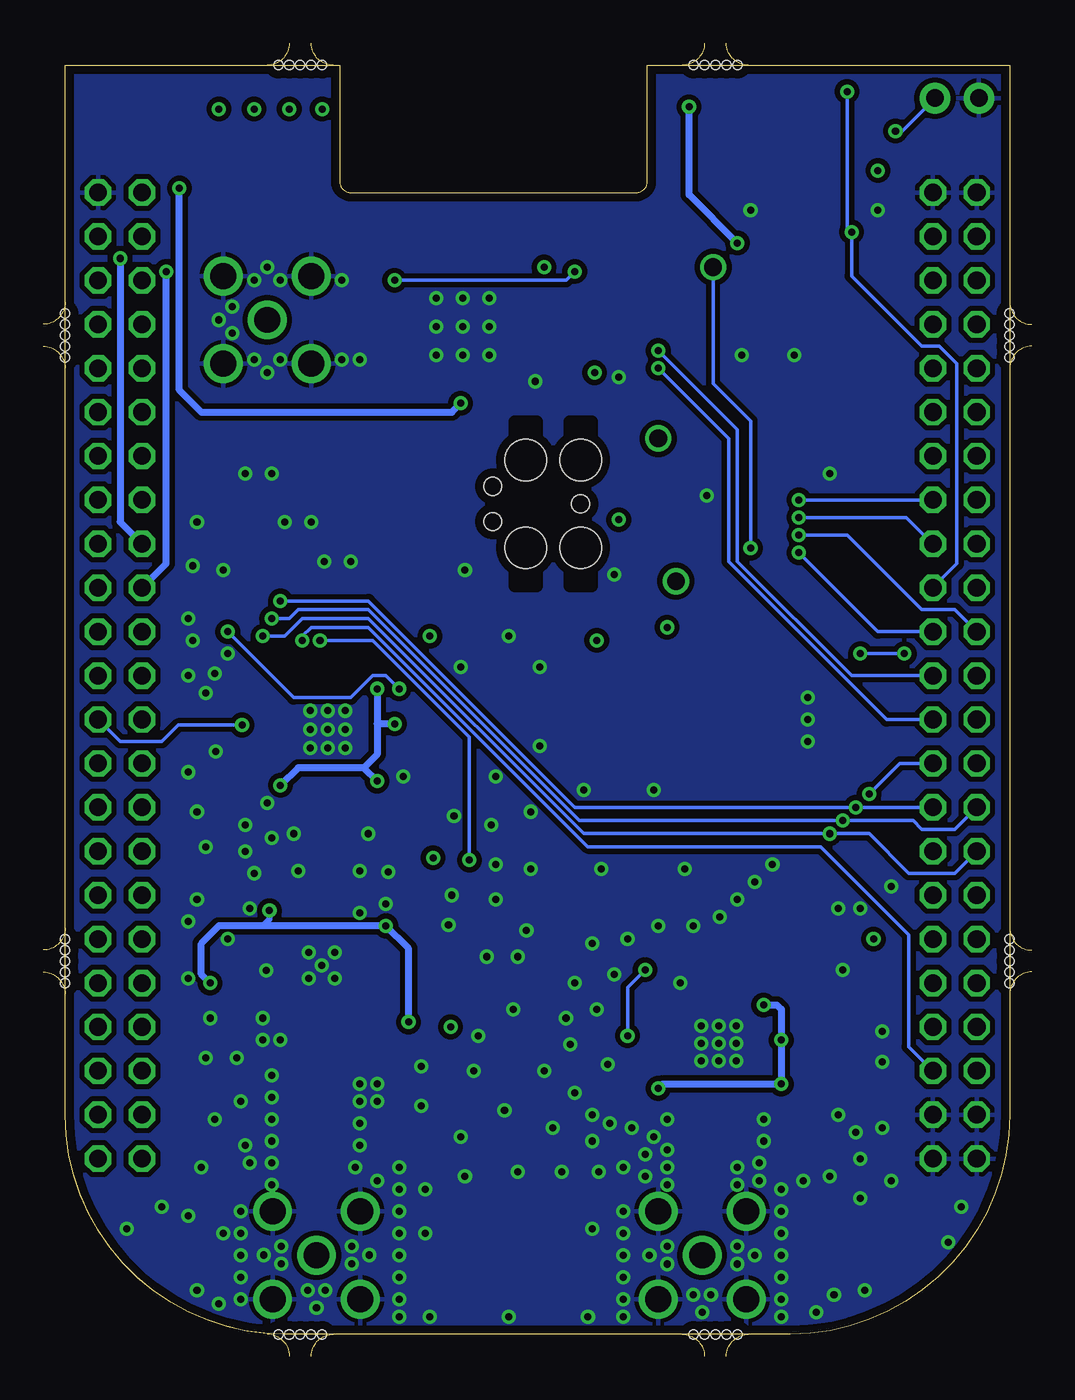
[diagram p8: board, bottom side, seen from below]

Size 57.15 x 75.95 mm. Coordinates in mm from the lower left corner, seen from the top.
Outline: 0,23.5 arc90 1.27,24.77 1.27,57.15 arc90 0,58.42
Outline: 0,22.22 arc-90 1.27,20.95 1.27,13.97 arc90 13.97,1.27 16.38,1.27 arc-90 17.65,0
Outline: 0,59.69 arc90 1.27,60.96 1.27,74.68 16.38,74.68 arc90 17.65,75.95
Outline: 57.15,59.69 arc-90 55.88,60.96 55.88,74.68 44.2,74.68 arc-90 42.93,75.95
Outline: 57.15,58.42 arc90 55.88,57.15 55.88,24.77 arc90 57.15,23.5
Outline: 57.15,22.22 arc90 55.88,20.95 55.88,13.97 arc-86 44.2,1.31 arc87 42.93,0
Outline: 41.66,75.95 arc-90 40.39,74.68 40.01,74.68 40.01,67.94 arc-90 39.37,67.31 22.86,67.31 arc-90 22.22,67.94 22.22,74.68 20.19,74.68 arc-90 18.92,75.95
Outline: 18.92,0 arc-90 20.19,1.27 40.39,1.27 arc-90 41.66,0
Copper layers (1+2*15+16): Top 0.0178mm / dielectric 12mil / GND 0.0356mm / dielectric 28mil / VCC 0.0356mm / dielectric 12mil / Bottom 0.0178mm
Design rules "sunstone-4lyr_v1.0.0.3 *": minimum track width 6mil, minimum drill 8mil, track to track 6mil, track to pad 6mil, pad to pad 6mil, via to via 6mil, smd to smd 6mil, copper to edge 20mil, drill to drill 16mil, minimum pad ring 8mil, minimum via ring 8mil, stop-mask expansion 3mil, vias tented up to drill 25mil, thermal gap 10mil
Holes 0.51 mm at 1.27,22.86 1.27,23.5 1.27,24.13 1.27,22.22 1.27,21.59 1.27,59.05 1.27,59.69 1.27,60.33 1.27,58.42 1.27,57.79 55.88,59.05 55.88,58.42 55.88,57.79 55.88,59.69 55.88,60.33 55.88,22.86 55.88,23.5 55.88,24.13 55.88,22.22 55.88,21.59 42.29,74.68 42.93,74.68 43.56,74.68 41.66,74.68 41.02,74.68 18.29,74.68 18.92,74.68 19.56,74.68 17.65,74.68 17.02,74.68 18.29,1.27 17.65,1.27 17.02,1.27 18.92,1.27 19.56,1.27 42.29,1.27 41.66,1.27 41.02,1.27 42.93,1.27 43.56,1.27
Milling: 12 lines

### Footprints (pad centres in the part's own frame; a part is rotated, then mirrored left to right if it is on the bottom)
MOLEX_WM5544-ND = drill 1.499: GND1 0,5.08; GND2 5.08,5.08; GND3 0,0; GND4 5.08,0; SIGNAL 2.54,2.54
2450BM = smd 0.35 x 1: 1 0.65,0.9; 2 0,0.9; 3 -0.65,0.9; 4 -0.65,-0.9; 5 0,-0.9; 6 0.65,-0.9
BAL-NRF01D3 = smd 0.22 x 0.22: ANT1 -0.537,-0.25; ANT2 -0.537,0.25; GND 0.069,0.25; SE 0.537,0; VCC 0.069,-0.25
0402_CAP = smd 0.536 x 0.546: 1 -0.433,0; 2 0.433,0
C0402 = smd 0.536 x 0.546: 1 -0.433,0; 2 0.433,0
C0603 = smd 1.1 x 1: 1 -0.85,0; 2 0.85,0
LED-0603 = smd 1 x 1: A 0,-0.877; C 0,0.877
TC2030-IDC = smd 0.787 x 0.787: 1 -1.27,-0.635; 2 -1.27,0.635; 3 0,-0.635; 4 0,0.635; 5 1.27,-0.635; 6 1.27,0.635 | hole 2.375: -2.54,2.54; 0.635,2.54; 0.635,-2.54; -2.54,-2.54 | hole 1.016: -2.54,0; 2.54,1.016; 2.54,-1.016
PTH-JUMPER-2-NO_NO_SILK = drill 1.016 pad 1.778: 1 -1.27,0; 2 1.27,0
0603_CAP = smd 0.7 x 1: 1 -0.65,0; 2 0.65,0
0603 = smd 1.1 x 1: 1 -0.85,0; 2 0.85,0
BBB_HEADERS = drill 1.016 octagon: P8_1 49.53,57.15; P8_2 52.07,57.15; P8_3 49.53,54.61; P8_4 52.07,54.61; P8_5 49.53,52.07; P8_6 52.07,52.07; P8_7 49.53,49.53; P8_8 52.07,49.53; P8_9 49.53,46.99; P8_10 52.07,46.99; P8_11 49.53,44.45; P8_12 52.07,44.45; P8_13 49.53,41.91; P8_14 52.07,41.91; P8_15 49.53,39.37; P8_16 52.07,39.37; P8_17 49.53,36.83; P8_18 52.07,36.83; P8_19 49.53,34.29; P8_20 52.07,34.29; P8_21 49.53,31.75; P8_22 52.07,31.75; P8_23 49.53,29.21; P8_24 52.07,29.21; P8_25 49.53,26.67; P8_26 52.07,26.67; P8_27 49.53,24.13; P8_28 52.07,24.13; P8_29 49.53,21.59; P8_30 52.07,21.59; P8_31 49.53,19.05; P8_32 52.07,19.05; P8_33 49.53,16.51; P8_34 52.07,16.51; P8_35 49.53,13.97; P8_36 52.07,13.97; P8_37 49.53,11.43; P8_38 52.07,11.43; P8_39 49.53,8.89; P8_40 52.07,8.89; P8_41 49.53,6.35; P8_42 52.07,6.35; P8_43 49.53,3.81; P8_44 52.07,3.81; P8_45 49.53,1.27; P8_46 52.07,1.27; P9_1 1.27,57.15; P9_2 3.81,57.15; P9_3 1.27,54.61; P9_4 3.81,54.61; P9_5 1.27,52.07; P9_6 3.81,52.07; P9_7 1.27,49.53; P9_8 3.81,49.53; P9_9 1.27,46.99; P9_10 3.81,46.99; P9_11 1.27,44.45; P9_12 3.81,44.45; P9_13 1.27,41.91; P9_14 3.81,41.91; P9_15 1.27,39.37; P9_16 3.81,39.37; P9_17 1.27,36.83; P9_18 3.81,36.83; P9_19 1.27,34.29; P9_20 3.81,34.29; P9_21 1.27,31.75; P9_22 3.81,31.75; P9_23 1.27,29.21; P9_24 3.81,29.21; P9_25 1.27,26.67; P9_26 3.81,26.67; P9_27 1.27,24.13; P9_28 3.81,24.13; P9_29 1.27,21.59; P9_30 3.81,21.59; P9_31 1.27,19.05; P9_32 3.81,19.05; P9_33 1.27,16.51; P9_34 3.81,16.51; P9_35 1.27,13.97; P9_36 3.81,13.97; P9_37 1.27,11.43; P9_38 3.81,11.43; P9_39 1.27,8.89; P9_40 3.81,8.89; P9_41 1.27,6.35; P9_42 3.81,6.35; P9_43 1.27,3.81; P9_44 3.81,3.81; P9_45 1.27,1.27; P9_46 3.81,1.27
R0402 = smd 0.536 x 0.546: 1 -0.433,0; 2 0.433,0
0603-RES = smd 0.7 x 1: 1 -0.65,0; 2 0.65,0
PAD-JUMPER-3-NO_YES_SILK_FULL_BOX = smd 1.168 x 1.6: 1 -1.524,0; 2 0,0; 3 1.524,0
PAD-JUMPER-2-NC_BY_TRACE_YES_SILK = smd 0.635 x 1.27: 1 -0.508,0; 2 0.508,0
TESTPOINT_0.040IN = drill 1.016: TESTPOINT 0,0
TP14SQ = smd 1.4 x 1.4: TP 0,0
S-PVQFN-N28 = smd 1 x 0.28: 1 -2.4,1.5; 2 -2.4,1; 3 -2.4,0.5; 4 -2.4,0; 5 -2.4,-0.5; 6 -2.4,-1; 7 -2.4,-1.5; 15 2.4,-1.5; 16 2.4,-1; 17 2.4,-0.5; 18 2.4,0; 19 2.4,0.5; 20 2.4,1; 21 2.4,1.5 | smd 0.28 x 1: 8 -1.5,-2.4; 9 -1,-2.4; 10 -0.5,-2.4; 11 0,-2.4; 12 0.5,-2.4; 13 1,-2.4; 14 1.5,-2.4; 22 1.5,2.4; 23 1,2.4; 24 0.5,2.4; 25 0,2.4; 26 -0.5,2.4; 27 -1,2.4; 28 -1.5,2.4 | smd 3.15 x 3.15: THERMALPAD 0,0
CAT24C256WI-GT3 = smd 2.2 x 0.6: A0 -2.6,1.91; A1 -2.6,0.65; A2 -2.6,-0.64; SCL 2.6,-0.64; SDA 2.6,-1.91; VCC 2.6,1.91; VSS -2.6,-1.91; WP 2.6,0.64
PVQFN-16 = smd 0.35 x 0.825: 1 -0.975,-2.013; 2 -0.325,-2.013; 3 0.325,-2.013; 4 0.975,-2.013; 9 0.975,2.013; 10 0.325,2.013; 11 -0.325,2.013; 12 -0.975,2.013 | smd 0.825 x 0.35: 5 2.013,-0.975; 6 2.013,-0.325; 7 2.013,0.325; 8 2.013,0.975; 13 -2.013,0.975; 14 -2.013,0.325; 15 -2.013,-0.325; 16 -2.013,-0.975 | smd 2.16 x 2.16: PAD 0,0
TSSOP16 = smd 0.9 x 0.35: 1 -2.875,2.275; 2 -2.875,1.625; 3 -2.875,0.975; 4 -2.875,0.325; 5 -2.875,-0.325; 6 -2.875,-0.975; 7 -2.875,-1.625; 8 -2.875,-2.275; 9 2.875,-2.275; 10 2.875,-1.625; 11 2.875,-0.975; 12 2.875,-0.325; 13 2.875,0.325; 14 2.875,0.975; 15 2.875,1.625; 16 2.875,2.275
QFN-48-6MM = smd 0.8 x 0.25: 1 -3,2.2; 2 -3,1.8; 3 -3,1.4; 4 -3,1; 5 -3,0.6; 6 -3,0.2; 7 -3,-0.2; 8 -3,-0.6; 9 -3,-1; 10 -3,-1.4; 11 -3,-1.8; 12 -3,-2.2; 25 3,-2.2; 26 3,-1.8; 27 3,-1.4; 28 3,-1; 29 3,-0.6; 30 3,-0.2; 31 3,0.2; 32 3,0.6; 33 3,1; 34 3,1.4; 35 3,1.8; 36 3,2.2 | smd 0.25 x 0.8: 13 -2.2,-3; 14 -1.8,-3; 15 -1.4,-3; 16 -1,-3; 17 -0.6,-3; 18 -0.2,-3; 19 0.2,-3; 20 0.6,-3; 21 1,-3; 22 1.4,-3; 23 1.8,-3; 24 2.2,-3; 37 2.2,3; 38 1.8,3; 39 1.4,3; 40 1,3; 41 0.6,3; 42 0.2,3; 43 -0.2,3; 44 -0.6,3; 45 -1,3; 46 -1.4,3; 47 -1.8,3; 48 -2.2,3 | smd 4.6 x 4.6: GND 0,0
NX2520SA = smd 1.2 x 1: 1 -0.85,-0.85; 2 0.85,-0.85; 3 0.85,0.85; 4 -0.85,0.85
TXC-8Y = smd 0.9 x 0.8: 1 -0.7,-0.55; 2 0.7,-0.55; 3 0.7,0.55; 4 -0.7,0.55

### Placement (x,y rotation side)
ANT1  16.51,3.3 0 top
ANT2  38.81,3.3 0 top
ANT3  41.66,57.4 0 top
B1  18.1,13.02 270 top
B2  37.34,59.94 0 top
C1  38.67,60.38 90 top
C2  41.8,17.14 0 top
C3  40.92,12.29 180 top
C4  40.22,30.75 270 top
C5  41.2,30.75 270 top
C6  41.36,15.39 90 top
C7  37.08,64.77 270 top
C8  33.02,64.77 90 top
C9  38.35,17.48 270 top
C10  32.51,32.51 180 top
C11  9.4,20.32 180 top
C12  9.4,15.49 180 top
C13  32.51,37.08 180 top
C14  45.97,20.95 270 top
C15  43.04,26.42 90 top
C16  44.58,23.88 0 top
C17  38.35,62.74 0 top
C18  30.99,64.77 90 top
C19  37.82,58.93 0 top
C20  36.83,56.9 270 top
C21  13.46,14.61 180 top
C22  22.86,14.99 270 top
C23  13.33,22.35 180 top
C24  22.86,20.32 0 top
C25  12.19,67.31 180 top
C26  36.83,32 180 top
C27  45.72,33.02 270 top
C28  37.08,40.13 180 top
C29  45.47,38.35 0 top
C30  26.16,56.64 270 top
C31  26.92,61.72 0 top
C32  13.21,12.7 180 top
C33  35.31,30.23 180 top
C34  35.31,25.78 180 top
C35  27.18,56.64 270 top
D1  41.91,72.14 180 top
D2  43.94,72.14 180 top
D3  45.97,72.14 180 top
D4  48.01,72.14 180 top
J1  28.62,49.3 0 top
J2  4.32,72.77 180 top
L1  39.79,29.1 0 top
L2  41.64,29.08 180 top
L3  41.21,27.42 90 top
L4  40.92,13.55 180 top
L5  39.62,18.77 270 top
L6  41.36,18.9 90 top
L7  40.22,27.41 90 top
L8  37.8,19.33 180 top
L9  26.92,60.2 0 top
L10  28.45,60.71 90 top
L11  35.31,27.69 0 top
L12  11.43,23.88 180 top
L13  36.58,42.67 180 top
P9/P8  1.91,10.16 0 top
R1  41.91,69.09 90 top
R2  43.94,69.09 90 top
R3  45.97,69.09 90 top
R4  48.01,69.09 90 top
R5  34.29,23.88 180 top
R6  34.29,22.1 180 top
R7  46.76,22.94 180 top
R8  14.73,67.31 180 top
R9  14.73,65.41 180 top
R10  14.73,63.5 180 top
R11  12.19,63.5 0 top
R12  12.19,65.41 0 top
R13  9.14,70.36 90 top
R14  24.89,39.12 0 top
R15  23.62,40.39 0 top
R16  23.62,42.42 0 top
R17  35.44,54.65 0 top
R18  22.86,16.7 180 top
R19  45.47,35.05 180 top
R20  34.29,20.32 180 top
R21  20.19,22.61 180 top
R22  45.21,43.43 180 top
SJ1  19.43,67.18 0 top
SJ2  19.56,34.54 180 top
TP0  18.41,62.99 0 top
TP1  20.57,44.83 0 top
TP2  21.59,53.09 0 top
TP3  15.75,34.54 0 top
U1  18.1,18.1 270 top
U2  40.7,36.27 270 top
U3  14.99,71.63 180 top
U4  41.05,22.61 180 top
U5  18.29,38.86 0 top
U6  32.81,59.56 0 top
U$2  [UMICH_SOLID_200MIL]  6.35,4.32 0 top
X1  10.92,17.91 90 top
X2  34,34.8 90 top
X3  34.8,64.77 180 top

### Tracks (layer width: path | path; a pad name or v marks a point on that pad's centre or on a via)
5V
  Top 0.406: P9/P8.P9_7 P9/P8.P9_8
!RESET0  (via drill 0.41)
  Top 0.203: v23.37,18.54 22.92,18.1 U1.25 | v22.35,22.35 22.35,23.11 21.34,24.13 17.78,24.13 12.7,29.21 12.7,30.73 9.14,34.29 9.14,51.18 P9/P8.P9_12
  Bottom 0.203: v23.37,18.54 23.37,21.34 v22.35,22.35
!RESET1  (via drill 0.41)
  Top 0.203: U2.25 45.42,36.27 v45.66,36.51
  Bottom 0.203: v45.66,36.51 49.34,36.51 50.29,35.56 52.71,35.56 P9/P8.P8_26
!RESET2
  Top 0.203: U6.8 9.69,58.96 6.6,55.88 4.45,55.88 P9/P8.P9_11
AVDD  (via drill 0.41)
  Top 0.203: C17.1 37.34,62.74 v36.83,62.23 36.36,61.76 | 36.32,61.72 36.32,61.47 36.22,61.36 U6.35 | 36.36,61.76 U6.36 36.28,61.76 36.32,61.72 | 36.32,61.72 36.36,61.76 | v26.42,62.74 26.42,61.8 C31.1 L9.1
  Bottom 0.203: v36.83,62.23 26.92,62.23 v26.42,62.74
BIRQ  (via drill 0.41)
  Top 0.203: v13.46,49.53 13.97,49.53 20.57,56.13 22.1,56.13 23.73,57.76 U6.11
  Bottom 0.203: v13.46,49.53 P9/P8.P9_16
CCA0
  Top 0.203: U1.6 17.1,21.76 8.13,30.73 8.13,46.74 6.6,48.26 4.45,48.26 P9/P8.P9_15
CCA1
  Top 0.203: U2.6 39.7,41.99 48.51,50.8 52.71,50.8 P9/P8.P8_14
DCC
  Top 0.203: U6.2 L10.2
EN
  Top 0.203: U2.10 37.71,36.77 37.15,37.34 36.58,37.34 35.56,38.35 31.5,38.35 29.97,36.83 29.97,25.77 33.64,22.1 R6.2
FIFO0
  Top 0.203: U1.9 14.94,19.1 12.7,21.34 9.91,21.34 7.11,24.13 7.11,32.26 6.35,33.02 4.45,33.02 P9/P8.P9_27
FIFO1  (via drill 0.41)
  Top 0.203: U2.9 37.85,37.27 36.58,38.55 v36.58,38.61 | P9/P8.P8_16 52.71,48.26 50.8,48.26 50.04,47.5 50.04,45.47 v46.48,41.91
  Bottom 0.203: v36.58,38.61 37.34,39.37 38.1,39.37 39.37,38.1 42.67,38.1 v46.48,41.91
FIFOP0
  Top 0.203: U1.7 16.6,21.76 7.62,30.73 7.62,37.34 6.86,38.1 4.45,38.1 P9/P8.P9_23
FIFOP1
  Top 0.203: P9/P8.P8_13 49.02,52.07 39.2,42.25 U2.7
GND  (via drill 0.41)
  Top 0.203: 35.92,60.56 U6.33 36.31,60.56 36.45,60.71 36.45,60.83 36.32,60.96 U6.34 37.41,60.96 38.52,60.96 C1.2 38.67,61.79 38.86,61.98 39.62,61.98 v39.88,62.23 | C19.2 38.26,58.26 v38.86,57.66 | U6.13 28.88,56.56 v28.7,56.39 | J1.5 29.89,48.34 v32.77,45.47 | R21.1 20.57,22.61 20.57,21.84 v20.32,21.59
  Top 0.305: 37.4,60.56 37.4,60.2 B2.GND 37.41,60.96
  Top 0.356: B1.2 20.89,13.02 21.08,13.21 v21.08,13.72
  Top 0.406: U4.PAD 41.05,23.37 | R19.1 47.12,35.05 v47.18,34.99
  other vias: 24.51,16.89 44.26,22.31 10.92,22.35 11.18,25.91 8.13,27.18 9.91,25.91 11.18,13.97 10.16,12.95 8.64,13.21 8.64,17.02 8.64,18.8 11.68,10.41 9.91,11.43 14.48,8.38 17.02,10.92 17.02,9.91 21.08,10.92 21.08,11.94 21.08,9.91 21.08,6.35 21.08,5.33 18.54,3.56 19.56,3.56 17.02,6.35 17.02,5.33 16,5.84 19.05,2.54 22.1,5.84 15.49,13.72 15.49,12.45 15.75,10.16 14.48,9.65 14.48,7.11 14.48,5.84 14.48,4.57 14.48,3.3 14.48,2.29 23.62,2.29 23.62,3.3 23.62,4.57 23.62,5.84 23.62,7.11 23.62,8.38 15.75,11.18 22.35,10.41 23.62,10.92 23.11,13.21 22.35,11.68 21.84,12.7 9.65,3.81 4.83,6.6 4.06,8.64 12.45,2.54 14.99,28.45 16,27.43 17.02,26.42 18.03,25.4 19.56,24.89 21.59,24.89 23.37,24.13 24.13,22.1 25.15,20.07 26.67,18.03 26.42,15.24 25.4,13.97 25.4,23.88 26.42,21.59 26.92,19.56 28.19,16.51 27.69,13.21 25.4,12.45 24.38,13.46 13.21,10.16 8.13,10.16 12.95,36.83 12.95,35.56 33.02,12.7 29.72,10.67 35.05,9.65 25.02,10.67 35.05,7.11 25.65,2.29 34.8,2.29 36.58,2.29 36.58,3.3 36.58,5.84 36.58,7.11 36.58,8.38 36.58,9.65 39.12,10.92 45.21,11.18 39.32,6.36 39.32,5.35 38.3,5.85 40.84,3.82 41.86,3.82 41.35,2.81 43.94,9.91 44.4,5.85 43.38,6.36 43.38,5.35 45.72,5.84 45.72,7.11 45.72,8.38 45.72,4.57 45.72,3.3 36.58,4.57 43.94,11.18 43.94,12.45 43.94,13.72 43.94,14.99 43.94,16.26 43.43,18.29 44.45,18.29 44.45,19.56 38.86,12.19 38.86,13.46 38.86,14.73 38.86,15.75 37.85,15.75 32.26,16.51 35.31,16.76 35.31,14.48 45.47,12.19 45.72,14.73 47.75,17.27 47.24,13.72 48.01,10.92 50.29,8.64 46.74,7.11 48.26,3.81 52.32,7.37 46.99,3.05 30.23,2.29 32.77,10.41 27.18,10.67 36.58,10.92 37.85,10.16 37.85,14.73 48.77,8.13 32,18.54 31.5,23.11 29.97,20.07 29.72,23.11 29.21,24.64 30.99,26.42 31.24,30.73 28.45,35.31 28.96,31.5 25.91,32.77 12.95,38.1 24.89,28.19 28.45,39.88 30.23,41.66 33.02,39.88 45.21,25.91 46.48,24.13 48.77,25.15 47.5,19.56 45.97,17.27 42.42,28.07 45.47,30.73 44.2,32 42.67,30.23 43.94,29.97 44.96,27.94 48.77,21.84 38.86,25.65 37.34,26.16 38.86,28.07 37.21,28 36.32,33.53 38.35,30.23 11.68,51.05 24.13,45.21 18.8,49.78 39.37,45.97 41.66,48.26 48.51,45.72 46.74,45.47 43.18,48.26 43.94,51.05 48.26,48.26 48.77,42.67 48.51,41.4 48.77,39.37 47.75,38.35 48.26,31.5 48.77,33.78 47.75,29.46 48.26,26.42 30.48,14.22 18.1,18.1 19.11,18.1 19.11,19.11 18.1,19.11 17.08,19.11 17.08,18.1 17.08,17.08 18.1,17.08 19.11,17.08 41.05,22.61 40.28,23.37 41.81,23.37 40.28,21.84 41.81,21.84 39.69,37.34 40.7,37.34 41.72,37.34 39.69,36.26 40.7,36.26 41.72,36.26 39.69,35.18 40.7,35.18 41.72,35.18 9.91,9.14 11.43,3.56 25.4,7.37 28.96,28.19 30.99,33.53 33.4,31.24 30.99,28.45 47.24,39.5 46.48,40.64 45.47,29.21 33.53,26.67 33.72,24.96 45.47,51.05 40.89,45.97 39.88,57.66 43.43,62.23 44.96,62.23 44.2,62.99 46.23,60.71 46.23,59.18 46.99,59.94 43.43,57.66 44.96,57.66 44.2,56.9 31.37,61.21 32.89,61.21 34.42,61.21 31.37,59.56 32.89,59.56 34.42,59.56 31.37,57.91 32.89,57.91 34.42,57.91 23.88,56.64 13.72,57.91 16.76,57.91 16.26,66.29 8.89,66.29 21.84,32.77 20.07,28.19
  pour Bottom (isolate 0.305): 1.27,74.68 55.88,74.68 55.88,1.27 1.27,1.27
  pour Top: 55.88,74.68 1.27,74.68 1.27,1.29 6.47,1.27 17.27,1.27 17.27,13.72 20.83,13.72 20.87,1.27 39.37,1.27 39.37,10.92 40.13,11.68 40.13,14.1 39.62,14.73 39.62,19.81 39.12,19.81 39.12,34.04 42.16,34.04 42.16,20.07 42.93,20.07 42.93,18.35 42.35,17.78 42.35,16.51 42.42,16.45 43.18,15.75 43.18,1.27 55.88,1.27 55.88,58.17 36.07,58.17 36.07,61.72 55.88,61.72
  pour GND: 1.27,1.27 55.88,1.27 55.88,74.68 1.27,74.68
  pour Top: 20.57,13.21 20.57,4.32 17.53,4.32 17.53,13.21 15.75,13.21 15.75,1.27 22.35,1.27 22.35,13.21
  pour Top (no thermals): 37.59,1.27 37.59,17.78 40.01,17.78 40.01,14.48 40.77,14.1 40.77,11.73 39.84,11.05 39.84,1.27
  pour Top (no thermals): 42.86,1.27 42.86,15.94 41.97,16.51 41.97,17.78 42.74,18.35 42.74,20.07 46.74,20.07 46.74,1.27
  pour Top: 39.37,1.27 43.18,1.27 43.38,4.33 39.57,4.33
  pour Top: 38.1,20.32 43.18,20.32 43.18,22.1 38.1,22.1
  pour Top (no thermals): 39.62,23.85 39.62,33.25 38.1,33.27 38.1,23.88 39.37,23.88
  pour Top (no thermals): 41.82,33.26 41.82,23.86 43.18,23.88 43.18,33.27
  pour Top: 17.27,1.27 17.27,4.06 20.83,4.06 20.83,1.27
  pour Top: 55.88,61.98 36.07,61.98 36.07,61.47 45.72,61.47 45.72,58.42 36.07,58.42 36.07,57.91 55.88,57.91
LED0  (via drill 0.41)
  Top 0.406: v50.04,62.74 47.24,65.53 42.67,65.53 41.91,66.29 R1.1
  Bottom 0.406: P9/P8.P8_19 50.04,45.85 v50.04,62.74
LED1  (via drill 0.41)
  Top 0.406: v52.71,63.5 50.42,63.5 47.62,66.29 44.7,66.29 43.94,67.06 R2.1
  Bottom 0.406: v52.71,63.5 52.71,48.26 P9/P8.P8_17
LED2
  Top 0.406: P9/P8.P8_18 55.12,48.13 55.12,65.53 54.61,66.04 49.28,66.04 48.26,67.06 46.48,67.06 45.97,67.56 R3.1
N$1
  Top 0.406: R1.2 D1.C
N$2
  Top 0.406: R2.2 D2.C
N$3
  Top 0.406: R3.2 D3.C
N$5  (via drill 0.41)
  Top 0.203: U1.24 25.22,17.6 25.4,17.78
  Top 0.406: U1.26 22.09,18.6 22.86,19.37 23.81,19.37 25.4,17.78 25.4,16.51 24.38,15.49 v21.59,15.49 | U1.20 19.1,14.94 19.3,14.73 20.83,14.73 v21.59,15.49 | U1.22 20.5,16.59 v21.59,15.49 | U1.16 17.1,15.07 16.76,14.73 14.24,14.73 | v21.59,15.49 22.72,15.49 C22.1 | U1.11 14.67,18.1 v14.48,18.29 | U1.8 15.7,20.12 v15.49,20.32 15.49,21.84 14.99,22.35 C23.1 13.77,23.06 13.21,23.62 12.53,23.62 L12.1 | 14.11,12.75 C32.1 13.89,12.86 C21.1 14.11,14.61 14.24,14.73 | U1.14 15.33,16.6 v14.48,15.75 14.24,15.51 14.24,14.73
  Bottom 0.406: v21.59,15.49 21.34,15.75 v14.48,15.75 v14.48,18.29 14.48,20.07 14.73,20.32 v15.49,20.32
N$7
  Top 0.356: ANT1.SIGNAL 19.05,12.31 B1.1
N$11
  Top 0.203: U1.13 11.81,17.1 X1.1 11.77,16.34 10.92,15.49 C12.1
N$12
  Top 0.203: U1.27 21.2,19.1 C24.1
N$13
  Top 0.203: U1.12 13.64,17.6 12.95,18.29 12.95,19.3 12.45,19.81 11.13,19.81 X1.3 | 10.05,18.78 X1.3 | C11.1 9.83,19 X1.3
N$14
  Top 0.203: U1.23 22.03,17.1 R18.2
N$29
  Top 0.406: R8.1 17.78,67.31 SJ1.1 17.91,69.4 U3.A0
N$30
  Top 0.406: U3.A1 16.94,70.87 19.05,70.87 20.95,68.96 SJ1.3 20.95,66.17 20.19,65.41 R9.1
N$31  (via drill 0.41)
  Top 0.203: U3.WP 9.16,70.99 R13.2 9,70.87 v7.87,70.87
  Bottom 0.203: v7.87,70.87 7.49,70.87 J2.1
N$32  (via drill 0.41)
  Top 0.406: U3.A2 v19.81,72.26 | R10.1 16.13,63.5 v17.02,64.39
  Bottom 0.406: v17.02,64.39 19.81,67.18 v19.81,72.26
N$36
  Top 0.203: U6.31 36.73,59.76 B2.ANT1
N$37
  Top 0.203: U6.32 36.77,60.16 B2.ANT2
N$38
  Top 0.406: ANT3.SIGNAL B2.SE C1.1
N$39
  Top 0.203: 27.47,60.06 L9.2 27.5,60.06 L10.1
N$40
  Top 0.203: U6.37 35.01,62.95 35.31,63.25 35.81,63.25 36.32,63.75 36.32,64.77 36.07,65.02 | 36.07,65.02 35.79,65.02 X3.1 | 36.07,65.02 36.25,65.2 C7.1
N$41
  Top 0.203: U6.38 34.61,63.18 34.29,63.5 34.29,64.03 X3.3 33.14,64.22 C8.1
N$42
  Top 0.203: U6.39 34.21,63.07 33.78,63.5 31.82,63.5 C18.1
N$43
  Top 0.203: U6.29 36.29,58.96 36.83,58.42 C20.1
N$44
  Top 0.356: U4.4 40.07,26.82 L7.1
N$45
  Top 0.356: U4.2 41.37,26.83 L3.1
N$46
  Top 0.508: C5.2 L2.2 L3.2
N$47
  Top 0.508: C4.2 L1.2 L7.2
N$48
  Top 0.203: L8.1 39.12,19.33 39.53,19.33 | 39.53,19.33 L5.1 | U4.10 40.72,20.12 39.93,19.33 39.53,19.33
N$49  (via drill 0.41)
  Top 0.203: U4.13 45.95,21.63 C14.1 46,21.63 47.46,21.63 v47.5,21.59 | v36.03,19.33 L8.2 | U4.16 43.85,23.58 C16.1
  Top 0.406: C16.1 44.14,25.71 v44.07,25.78 43.87,25.98 C15.1 43.04,25.64 U4.1 | v37.34,24.89 36.63,24.89 C34.1 L11.2
  Bottom 0.356: v44.07,25.78 44.07,25.27 44.45,24.89
  Bottom 0.406: v47.5,21.59 48.01,22.1 48.01,23.88 46.99,24.89 44.45,24.89 v37.34,24.89 36.03,23.58 v36.03,19.33
N$50
  Top 0.203: C9.1 38.35,18.21 38.48,18.34 L5.2
N$51
  Top 0.356: U4.11 L6.2
N$52
  Top 0.356: C3.1 ANT2.SIGNAL
  Top 0.508: C6.1 41.36,13.56 L4.1 C3.1
N$53
  Top 0.508: L6.1 C2.1 C6.2
N$54
  Top 0.203: 46.11,22.93 R7.2 46.06,22.99 42.96,22.99 U4.15
N$55
  Top 0.203: U4.5 35.24,23.58 34.94,23.88 R5.1
N$56
  Top 0.203: U4.6 35.77,22.93 34.94,22.1 R6.1
N$57  (via drill 0.41)
  Top 0.203: U2.24 47.79,35.77 48.01,35.56
  Top 0.406: U2.20 41.7,33.23 42.16,32.77 43.18,32.77 v43.43,33.02 43.94,33.53 | U2.22 43.71,34.77 43.94,34.54 43.94,33.53 | 43.94,33.53 45.65,33.53 C27.1 46.05,33.78 47.24,33.78 48.01,34.54 48.01,35.56 46.23,37.34 44.96,37.34 44.39,36.77 U2.26 | U2.11 37.13,36.27 v36.83,36.58 | U2.8 38.3,38.15 v37.85,38.61 37.85,39.8 C28.1 37.52,42.58 L13.1 37.73,42.67 | v37.85,33.27 37.26,32.69 C26.1 37.26,31.33 C33.1 | U2.14 38.3,33.73 v37.85,33.27 | v37.85,33.27 38.35,32.77 39.31,32.77 39.7,33.16 U2.16
  Bottom 0.406: v43.43,33.02 42.42,34.04 38.61,34.04 | v37.85,38.61 37.85,36.58 | 37.85,36.58 37.85,34.8 38.61,34.04 | v36.83,36.58 37.85,36.58 | 38.61,34.04 v37.85,33.27
N$58
  Top 0.203: U2.27 43.73,37.27 C29.1
N$59
  Top 0.203: U2.13 36.18,35.27 X2.1 34.85,33.58 34.04,32.77 33.2,32.77 C10.1
N$60
  Top 0.203: U2.12 36.36,35.77 35.56,36.58 34.08,36.58 X2.3 33.15,37.07 C13.1
N$61
  Top 0.203: U2.23 44.81,35.27 R19.2
N$62
  Top 0.203: R20.1 34.94,20.32 36.9,22.28 U4.7
N$63
  Top 0.406: R4.2 D4.C
N$64  (via drill 0.41)
  Top 0.203: v33.02,55.12 U6.19
  Top 0.406: v49.28,67.56 48.19,68.66 R4.1
  Bottom 0.406: v33.02,55.12 33.53,54.61 48.01,54.61 49.28,55.88 v49.28,67.56
N$65
  Top 0.203: SJ2.1 20.32,34.54 21.08,35.31 21.08,36.51 U5.9
PAEN  (via drill 0.41)
  Top 0.203: v32.51,28.7 32.51,25 33.64,23.88 R5.2 | U2.4 40.7,40.96 v41.15,41.4
  Bottom 0.203: v41.15,41.4 38.1,41.4 32.51,35.81 v32.51,28.7
RF_N
  Top 0.254: U1.19 18.6,14.07 B1.3
RF_N2
  Top 0.152: U2.19 C5.1
RF_P
  Top 0.254: U1.17 17.6,14.07 B1.4
RF_P2
  Top 0.152: 40.22,33.87 C4.1
  Top 0.203: U2.17 40.22,33.87
SCL
  Top 0.203: 7.11,62.23 7.11,59.18 6.35,58.42 2.54,58.42 2.03,57.91 2.03,45.59 P9/P8.P9_19 | 7.11,62.23 7.11,71.5 7.88,72.27 U3.SCL | R11.1 8.38,63.5 7.11,62.23
SDA  (via drill 0.41)
  Top 0.203: U3.SDA 11.05,73.54 v10.67,73.15 | R12.1 10.79,65.41 v10.41,65.02
  Bottom 0.203: v10.67,73.15 10.67,65.28 v10.41,65.02 10.41,62.48 6.35,58.42 5.33,58.42 4.32,57.4 4.32,45.85 P9/P8.P9_20
SFD0
  Top 0.203: U1.5 17.6,21.77 8.64,30.73 8.64,49.15 P9/P8.P9_14
SFD1
  Top 0.203: U2.5 40.2,41.73 48.01,49.53 P9/P8.P8_15
SPI0_CS0  (via drill 0.41)
  Top 0.203: P9/P8.P9_17 3.17,46.1 4.45,44.83 4.45,41.28 5.08,40.64 v7.37,40.64 | v9.91,40.64 13.97,40.64 14.73,39.88 15.24,39.88 | 15.24,39.88 15.37,39.88 | U5.3 15.24,39.84 15.24,39.88
  Bottom 0.203: v7.37,40.64 v9.91,40.64
SPI0_CS0_0  (via drill 0.41)
  Top 0.203: R14.1 24.39,39.19 U5.13 20.25,39.19 18.54,40.89 18.54,44.45 v16.26,46.74
  Bottom 0.203: v16.26,46.74 16.26,54.1 18.41,56.26 TP0.TESTPOINT
SPI0_CS0_1
  Top 0.203: R15.1 22.64,39.84 U5.14 20.36,39.84 19.81,40.39 19.81,44.07 TP1.TESTPOINT
SPI0_CS0_2
  Top 0.203: 22.61,53.09 23.62,54.1 30.73,54.1 32.21,55.58 U6.17 | U5.15 21.69,40.49 22.61,41.4 22.61,41.91 | TP2.TESTPOINT 22.61,53.09 | 22.61,53.09 22.61,41.91 | R16.1 23.11,42.42 22.61,41.91
SPI0_CS0_3
  Top 0.203: U5.12 19.74,38.54 TP3.TP
SPI0_CS0_SEL0
  Top 0.203: P9/P8.P8_11 44.96,54.61 28.23,37.89 U5.11
SPI0_CS0_SEL1
  Top 0.203: P9/P8.P8_12 52.71,53.34 44.45,53.34 28.35,37.24 U5.10
SPI0_MISO  (via drill 0.41)
  Top 0.203: U6.15 31.41,55.8 30.73,55.12 20.57,55.12 14.22,48.77 14.22,48.26 v13.46,47.5
  Bottom 0.203: P9/P8.P9_21 4.45,43.18 6.35,43.18 10.67,47.5 v13.46,47.5
SPI0_MOSI  (via drill 0.41)
  Top 0.203: U6.14 31.01,55.9 30.73,55.63 20.57,55.63 v13.46,48.51
  Bottom 0.203: P9/P8.P9_18 7.24,48.51 v13.46,48.51
SPI0_SCLK  (via drill 0.41)
  Top 0.203: U6.16 31.81,55.69 30.73,54.61 20.57,54.61 14.73,48.77 14.73,47.75 v13.46,46.48
  Bottom 0.203: P9/P8.P9_22 8.89,41.91 v13.46,46.48
SPI1_CS0  (via drill 0.41)
  Top 0.203: U1.3 18.6,21.28 9.4,30.48 v9.4,32.51
  Bottom 0.203: P9/P8.P9_28 7.62,34.29 v9.4,32.51
SPI1_CS1  (via drill 0.41)
  Top 0.203: U2.3 41.2,40.44 v42.16,41.4
  Bottom 0.203: v42.16,41.4 42.16,41.66 41.66,42.16 38.35,42.16 25.65,29.46 12.19,29.46 7.11,24.38 7.11,17.91 P9/P8.P9_42
SPI1_MISO  (via drill 0.41)
  Top 0.203: U1.1 19.6,22.55 R21.2 18.29,22.61 10.92,29.97 v10.92,30.99 | 44.7,43.29 R22.2 44.7,43.43 v43.94,42.67 43.69,42.42 43.69,41.15 42.2,39.66 U2.1
  Bottom 0.203: P9/P8.P9_29 4.45,30.48 6.35,30.48 6.86,30.99 v10.92,30.99 26.16,30.99 38.35,43.18 42.42,43.18 42.93,42.67 v43.94,42.67
SPI1_MOSI  (via drill 0.41)
  Top 0.203: U1.2 19.1,21.29 10.16,30.23 v10.16,31.75 | U2.2 41.7,39.92 42.93,41.15 42.93,43.18 v43.43,43.69
  Bottom 0.203: P9/P8.P9_30 v10.16,31.75 26.42,31.75 38.35,43.69 v43.43,43.69
SPI1_SCLK  (via drill 0.41)
  Top 0.203: U1.28 20.87,19.6 21.59,20.32 21.59,23.11 21.08,23.62 17.78,23.62 11.68,29.72 v11.68,30.23 | U2.28 43.1,39.8 44.45,41.15 v44.45,41.66
  Bottom 0.203: P9/P8.P9_31 4.45,27.94 7.11,27.94 9.4,30.23 v11.68,30.23 25.91,30.23 38.35,42.67 42.16,42.67 43.18,41.66 v44.45,41.66
SWDCLK
  Top 0.203: U6.24 35.01,54.65 | 35.01,54.65 R17.1 | 35.01,54.65 35.01,51.78 32.54,49.3 29.21,49.3 28.62,49.89 J1.4
SWDIO
  Top 0.203: J1.2 27.69,50.27 27.69,52.83 28.45,53.59 32.51,53.59 34.61,55.69 U6.23
UARTRX  (via drill 0.41)
  Top 0.203: U6.9 21.99,58.56 v21.59,58.17
  Bottom 0.203: v21.59,58.17 17.02,53.59 17.02,45.97 10.41,39.37 P9/P8.P9_24
UARTTX  (via drill 0.41)
  Top 0.203: U6.10 22.6,58.16 v21.59,57.15
  Bottom 0.203: v21.59,57.15 17.53,53.09 17.53,45.97 8.38,36.83 P9/P8.P9_26
VCC  (via drill 0.41)
  Top 0.203: U3.VCC 9.15,69.72 | R13.1 9.14,68.83 v8.89,68.58 | U6.1 29.42,61.76 v28.19,62.99 | J1.1 26.82,48.67 26.54,48.39 v23.88,48.39 | U6.12 27.47,57.36 C35.1 C30.1 | R20.2 33.59,20.05 v33.59,19.05 | v21.08,42.16 21.16,42.08 U5.16 | R14.2 25.32,39.7 24.64,40.39 | 24.64,40.39 R15.2 | R16.2 24.64,42.42 25.15,41.91 v25.15,41.4 25.15,40.89 24.64,40.39
  Top 0.254: C30.1 25.45,57.08 v25.27,56.9 | 9.15,69.72 R13.1
  Top 0.406: L12.2 9.4,23.88 v9.14,24.13 | L11.1 34.61,27.69 v34.61,28.83 | L13.2 35.81,42.67 v34.8,41.66 | C25.1 R8.2 R9.2 R10.2 R11.2 | R12.2 C25.1 | D1.A arc45 41.89,73 v41.02,72.14 | D2.A arc45 43.71,72.91 v42.93,72.14 | D3.A 45.84,73.01 v44.96,72.14 | D4.A 47.87,73.01 v46.99,72.14 | C25.1 12.62,69.48 U3.VCC
  pour VCC: 1.27,1.27 55.88,1.27 55.88,74.68 1.27,74.68
VDD
  Top 0.406: P9/P8.P9_6 P9/P8.P9_5
VDD_PA
  Top 0.203: B2.VCC 37.41,58.94 C19.1 36.96,58.93 36.52,59.36 U6.30

### Text on the board
tPlace: EEPROM / WRITE | CS0-0 | nRF-CS | CS0-1 | CS0-3 | GAP | N.Jackson | D | 2015/04/03
tNames: P9 | P8 | GND | 3V3 | 5V | SYS_5V | !RST2 | !RST0 | CSE0 | CSE1 | SFD0 | FIP1 | CCA1 | CCA0 | BIRQ | SFD1 | FIO1 | 0CS0 | 0SI | LD1 | LD2 | SCL | SDA | LD0 | 0SO | 0SCLK | FIP0 | RX | TX | !RST1 | FIO0 | 1CS0 | 1SO | 1SI | 1SCLK
tDocu: CE1 | RXD | TXD | SCL | SDA